# EasyEDA Pro project deskpet.eprj

# Schematic Schematic1
Board Name: control board; Create Date: 2025-11-04; Page Name: P1; Project Name: deskpet; Schematic Name: Schematic1; Update Date: 2025-11-22; Company: EasyEDA.com; Page Size: A4; Version: V1.0
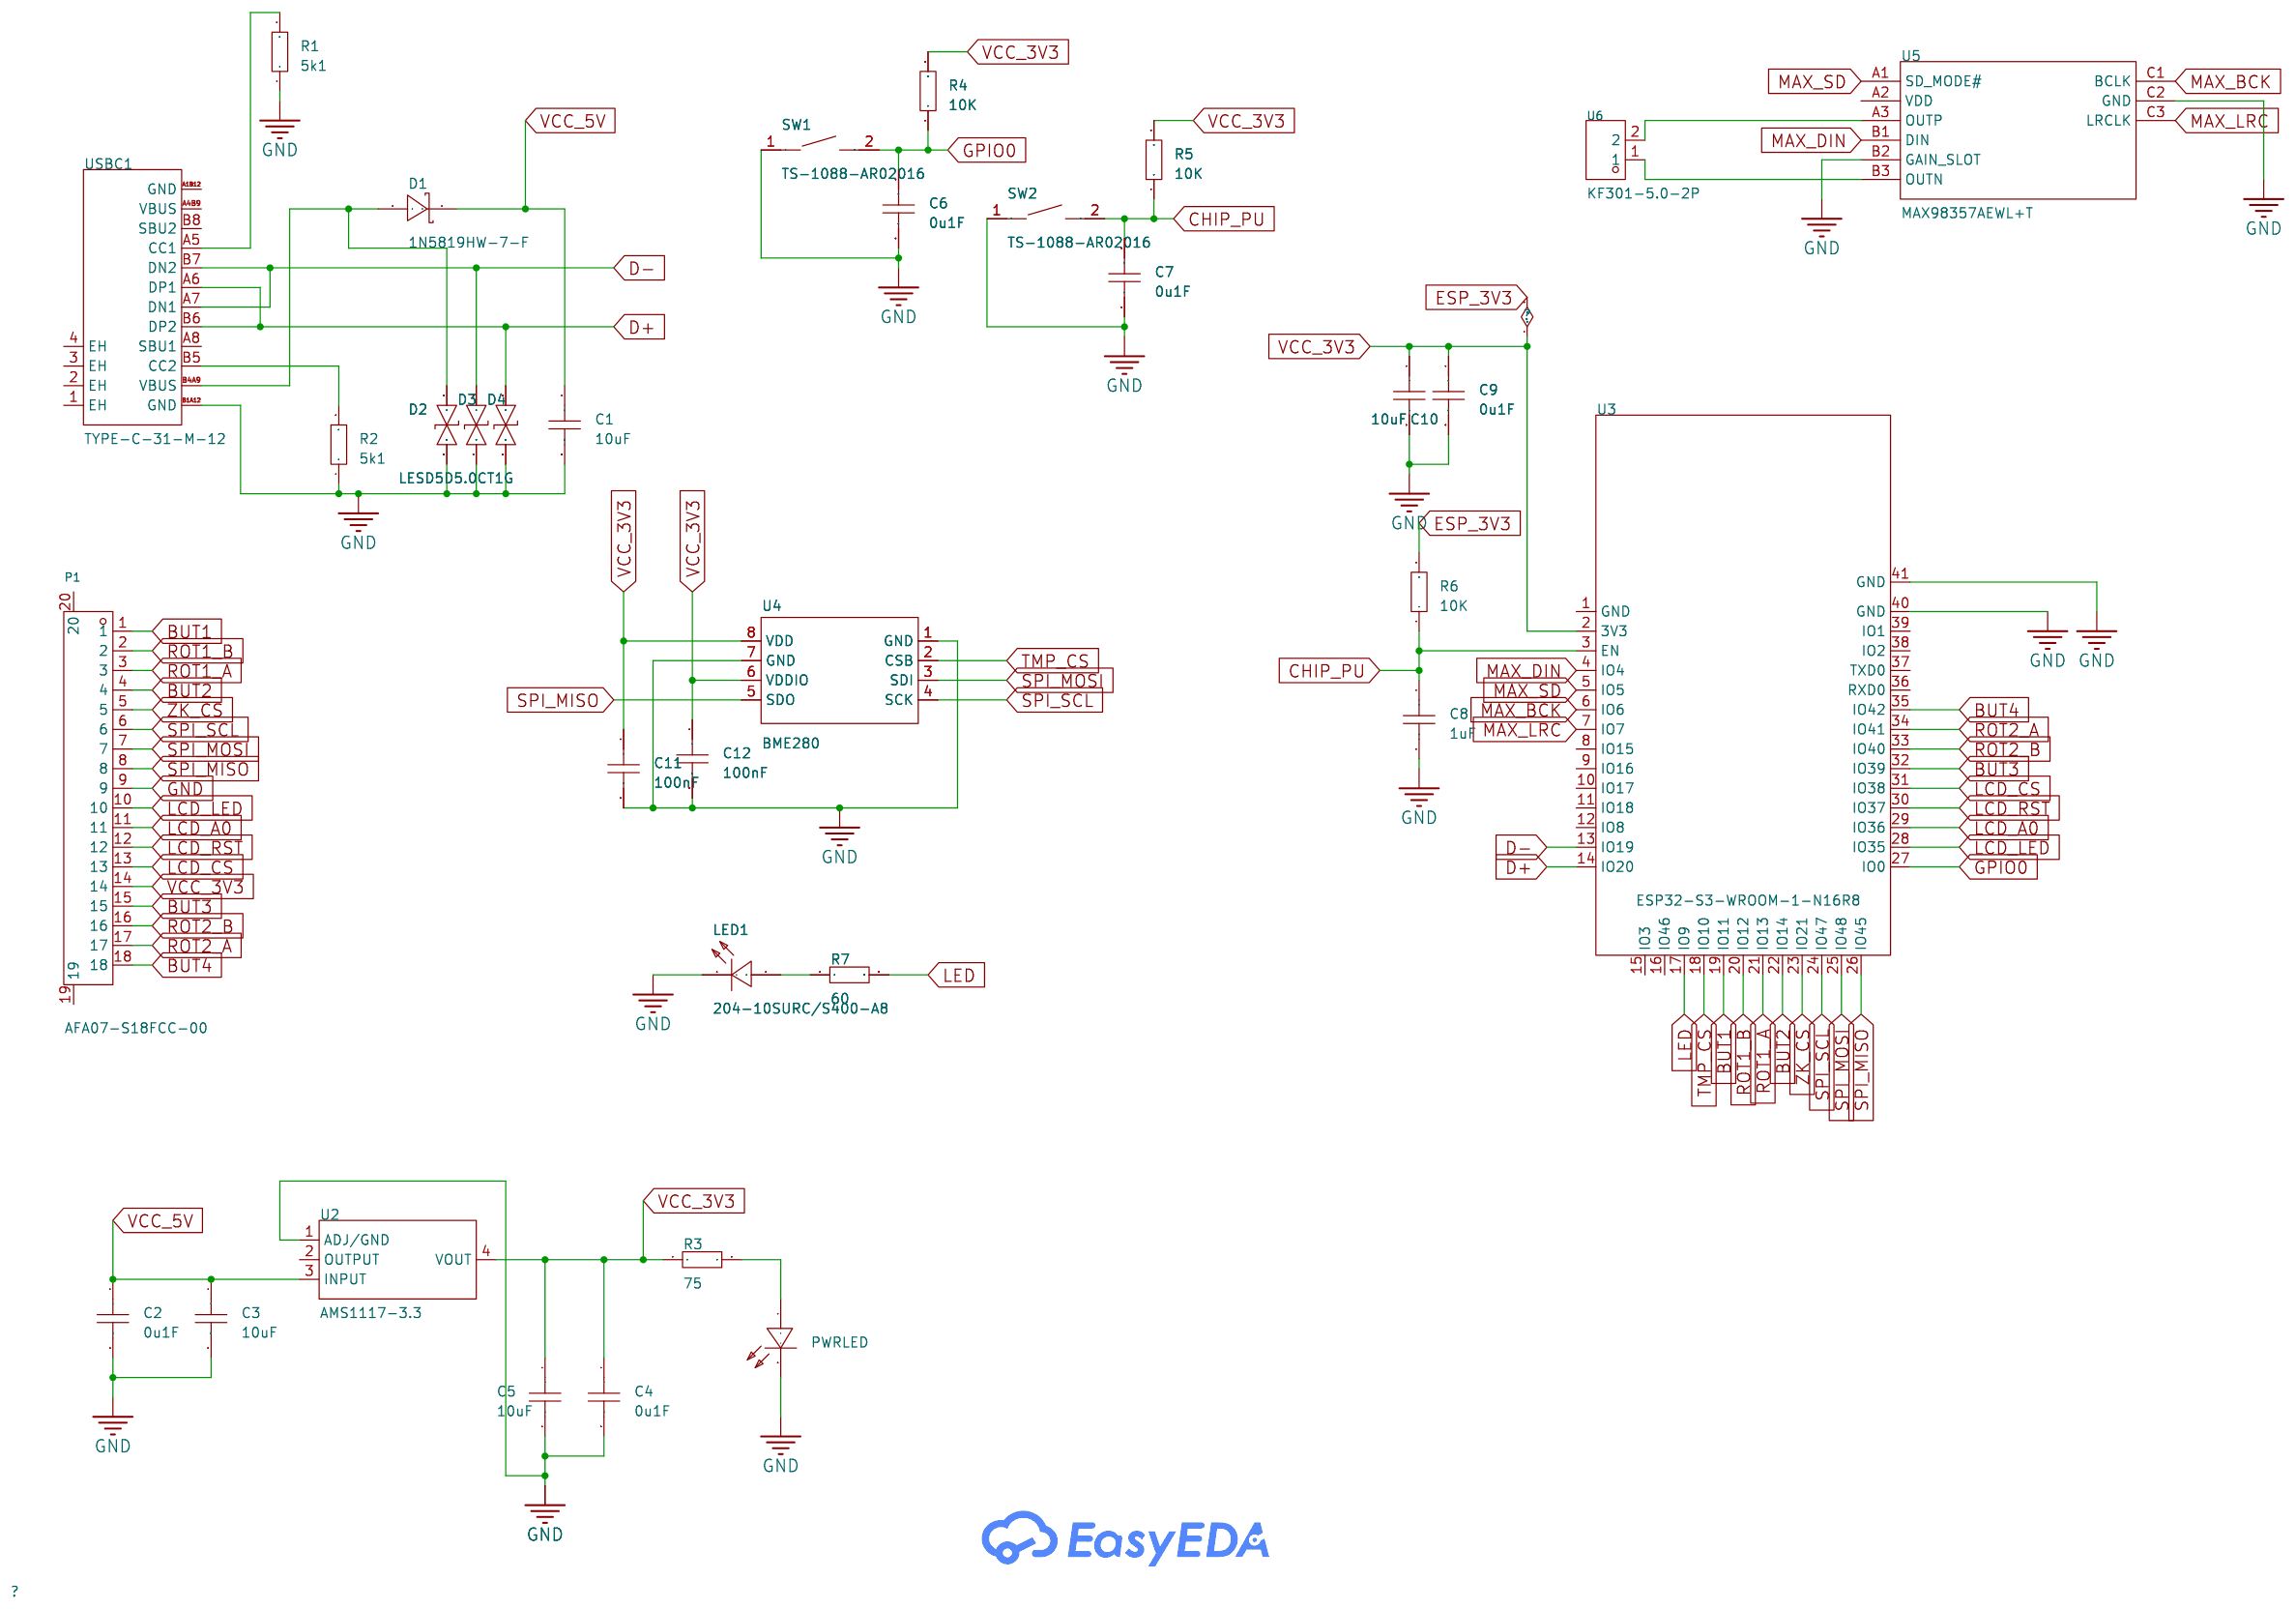
[diagram p0: schematic sheet]

## Parts
C1  10uF  [C0603]
C2  0u1F  [C0603]
C3  10uF  [C0603]
C4  0u1F  [C0603]
C5  10uF  [C0603]
C6  0u1F  [C0603]
C7  0u1F  [C0603]
C8  1uF  [C0603]
C9  0u1F  [C0603]
C10  10uF  [C0603]
C11  100nF  [C0603]
C12  100nF  [C0603]
D1  1N5819HW-7-F  [SOD-123_L2.7-W1.6-LS3.7-RD]
D2  LESD5D5.0CT1G  [SOD-523_L1.2-W0.8-LS1.6-BI]
D3  LESD5D5.0CT1G  [SOD-523_L1.2-W0.8-LS1.6-BI]
D4  LESD5D5.0CT1G  [SOD-523_L1.2-W0.8-LS1.6-BI]
LED1  204-10SURC/S400-A8  [LED-TH_BD3.0-P2.54-RD-WHITE]
P1  AFA07-S18FCC-00  [FPC-SMD_18P-P1.00_AFA07-S18FCC-00]
PWRLED  NCD0805R1  [LED0805-R-RD]
R1  5k1  [R0603]
R2  5k1  [R0603]
R3  75  [R0603]
R4  10K  [R0603]
R5  10K  [R0603]
R6  10K  [R0603]
R7  60  [R0603]
SW1  TS-1088-AR02016  [SW-SMD_L3.9-W3.0-P4.45]
SW2  TS-1088-AR02016  [SW-SMD_L3.9-W3.0-P4.45]
U2  AMS1117-3.3  [SOT-223-3_L6.5-W3.4-P2.30-LS7.0-BR]
U3  ESP32-S3-WROOM-1-N16R8  [WIRELM-SMD_ESP32-S3-WROOM-1]
U4  BME280  [LGA-8_BME280_BL]
U5  MAX98357AEWL+T  [WLP-9_L1.4-W1.3-P0.40-R3-C3-BR]
U6  KF301-5.0-2P  [CONN-TH_P5.00_KF301-5.0-2P]
USBC1  TYPE-C-31-M-12  [USB-C_SMD-TYPE-C-31-M-12_1]

## Library data of the parts
C1-C12 = CAP_0603: Supplier Footprint: 0603
D1 = 1N5819HW-7-F: LCSC Part Name: 电压:40V 电流:1A; Supplier Part: C82544; Manufacturer: DIODES(美台); Supplier Footprint: SOD-123; JLCPCB Part Class: Extended Part; Datasheet: https://item.szlcsc.com/datasheet/1N5819HW-7-F/83701.html; Supplier: LCSC; Diode Configuration: 1 Independent; Voltage - Forward(Vf@If): 450mV@1A; Voltage - DC Reverse(Vr): 40V; Current - Rectified: 1A; Reverse Leakage Current (Ir): 1mA@40V; Operating Junction Temperature Range: -65℃~+150℃; Non-Repetitive Peak Forward Surge Current: 25A
D2-D4 = LESD5D5.0CT1G_C41399463: LCSC Part Name: 双向ESD 5V截止 峰值脉冲电流：7A; Supplier Part: C41399463; Manufacturer: GOODWORK(固得沃克); Supplier Footprint: SOD-523; JLCPCB Part Class: Extended Part; Datasheet: https://item.szlcsc.com/datasheet/LESD5D5.0CT1G/43196790.html; Supplier: LCSC; Polarity: Bidirectional; Reverse Stand-Off Voltage (Vrwm): 5V; Clamping Voltage: 16V; Peak Pulse Current (Ipp): 7A; Peak Pulse Power Dissipation (Ppp): 100W; Voltage - Breakdown: 7V; Reverse Leakage Current (Ir): 1uA; Operating Temperature: -55℃~+150℃@(Tj); level of protection: IEC 61000-4-2; Type: ESD; Junction Capacitance: 12pF
LED1 = 204-10SURC/S400-A8: LCSC Part Name: 红灯; Supplier Part: C471418; Manufacturer: EVERLIGHT(亿光); Supplier Footprint: 插件,D=3mm; JLCPCB Part Class: Extended Part; Datasheet: https://atta.szlcsc.com/upload/public/pdf/source/20191231/C471418_B2E5B14029423C5111631A9992549771.pdf; Supplier: LCSC; Lamp Holder Type: 3mm圆形灯头; Emitted Color: Red; Forward Voltage (VF): 2V; Power Dissipation: 120mW; Forward Current: 20mA; Dominant Wavelength: 624nm; Peak Wavelength: 632nm; Lens Color: 无色透明透镜; Luminous Intensity: 2000mcd; Viewing Angle: 20°; Operating Temperature: -40℃~+85℃
P1 = AFA07-S18FCC-00: LCSC Part Name: 间距:1mm P数:18P 抽屉式 下接; Supplier Part: C23826; Manufacturer: JS(钜硕电子); Supplier Footprint: SMD,P=1mm,卧贴; JLCPCB Part Class: Extended Part; Datasheet: https://item.szlcsc.com/datasheet/AFA07-S18FCC-00/24565.html; Supplier: LCSC; Locking Feature: Slide Lock; Contact Type: Bottom Contact; Number of Contacts: 18P; Pitch: 1mm; Mounting Type: Surface Mount, Right Angle; FFC, FCB Thickness: 0.3mm; Height Above Board: 2.5mm
PWRLED = NCD0805R1_C84256: Supplier Part: C84256; Manufacturer: 国星光电; Supplier Footprint: 0805; JLCPCB Part Class: Basic Part; Datasheet: https://atta.szlcsc.com/upload/public/pdf/source/20200820/C84256_F0A75A43B3EAD75808600A0514C76B99.pdf; Supplier: LCSC; Emitted Color: Red; Forward Voltage (VF): 1.6V~2.6V; Power Dissipation: 65mW; Forward Current: 20mA; Dominant Wavelength: 615nm~630nm; Diode Configuration: 独立二极管; Lens Color: 无色透明透镜; Luminous Intensity: 67mcd~195mcd; Viewing Angle: 130°; Operating Temperature: -30℃~+85℃
R1-R7 = Res_0603: Supplier Footprint: 0603
SW1 SW2 = TS-1088-AR02016: LCSC Part Name: 4*3*2mm 立贴 轻触开关; Supplier Part: C720477; Manufacturer: XUNPU(讯普); Supplier Footprint: SMD,4x3mm; JLCPCB Part Class: Basic Part; Datasheet: https://item.szlcsc.com/datasheet/TS-1088-AR02016/763484.html; Supplier: LCSC; Circuit: SPST; Actuator Style: Round Button; Operating Force: 1.6N; Mounting Type: Surface Mount,Vertical; Length: 4mm; Width: 3mm; Switch Height: 2mm; with Bracket: Without Bracket; Contact Current: 50mA; Voltage Rating: 12V; Actuator/Cap Color: Black; Termination Style: SMD(SMT) Tab; Life: 100,000 Cycles; Operating Temperature: -30℃~+80℃
U2 = AMS1117-3.3_C18212698: Supplier Part: C18212698; Manufacturer: TECH PUBLIC(台舟); Supplier Footprint: SOT-223; JLCPCB Part Class: Extended Part; Datasheet: https://item.szlcsc.com/datasheet/AMS1117-3.3/19384486.html; Supplier: LCSC; Output Type: Fixed; Voltage - Supply: 12V; Output Voltage: 3.3V; Output Current: 1A; Voltage Dropout: 1.3V@(1A); standby current: 4mA; Output Configuration: Positive; Number of Outputs: 1
U3 = ESP32-S3-WROOM-1-N16R8: LCSC Part Name: 通用型Wi-Fi+低功耗蓝牙MCU模组; Supplier Part: C2913202; Manufacturer: ESPRESSIF(乐鑫); Supplier Footprint: SMD,25.5x18mm; JLCPCB Part Class: Extended Part; Datasheet: https://item.szlcsc.com/datasheet/ESP32-S3-WROOM-1-N16R8/3198300.html; Supplier: LCSC
U4 = BME280: LCSC Part Name: 湿度：0%RH~100%RH; Supplier Part: C92489; Manufacturer: Bosch(博世); Supplier Footprint: LGA-8(2.5x2.5); JLCPCB Part Class: Extended Part; Datasheet: https://item.szlcsc.com/datasheet/BME280/93682.html; Supplier: LCSC; Temperature Range: -40℃~+85℃; Humidity: 0%RH~100%RH; Interface: I2C；SPI; Voltage - Supply: 1.71V~3.6V; Current - Supply: 1.8uA; Humidity Tolerance: ±3%RH; Temperature Tolerance: ±0.5℃; Resolution: 16bit
U5 = MAX98357AEWL+T: LCSC Part Name: 微型、低成本、PCM 类 D 级放大器具有 AB 级性能; Supplier Part: C2682619; Manufacturer: ADI(亚德诺)/MAXIM(美信); Supplier Footprint: BGA-9(1.3x1.3); JLCPCB Part Class: Extended Part; Datasheet: https://atta.szlcsc.com/upload/public/pdf/source/20210106/C2682619_15CCD654F2C559A2FC5FDCA8EA0D4E6D.pdf; Supplier: LCSC; Speaker Channels: Monaural；Dual Channel; Voltage - Supply: 2.5V~5.5V; Operating Temperature: -40℃~+85℃
U6 = KF301-5.0-2P: LCSC Part Name: 5mm 1x2P 排数:1 每排P数:2 直插; Supplier Part: C474881; Manufacturer: KEFA(科发); Supplier Footprint: 插件,P=5mm; JLCPCB Part Class: Extended Part; Datasheet: https://atta.szlcsc.com/upload/public/pdf/source/20230317/03A5B5FC229D6F9225E8F51DA1A4E80A.pdf; Supplier: LCSC; Structure: 1x2P; Pitch: 5mm; Color: Blue; Mounting Style: Straight; Current Rating (Max): 17A; Voltage Rating (Max): 250V; Number of Pins: 2P; Number of Rows: 1; Wire Gauge - AWG: 14~22; Wire Gauge - mm2: 1.5; Number of PINs Per Row: 2; Operating Temperature Range: -30℃~+120℃
USBC1 = TYPE-C-31-M-12: LCSC Part Name: Type-C 母; Supplier Part: C165948; Manufacturer: 韩国韩荣; Supplier Footprint: SMD; JLCPCB Part Class: Extended Part; Datasheet: https://item.szlcsc.com/datasheet/TYPE-C-31-M-12/177331.html; Supplier: LCSC; Connector Type: Type-C; Gender: Female; Number of Contacts: 16P; Number of Ports: 1; Current Rating-Power: 5A

## Nets
GND: C1.2 C2.2 C3.2 C4.2 C5.2 C6.2 C7.2 C8.2 C9.2 C10.2 C11.2 C12.2 D2.2 D3.2 D4.2 LED1.1(-) P1.9 PWRLED.2(-) R1.1 R2.1 SW1.1 SW2.1 U2.1(ADJ/GND) U3.40(GND) U3.41(GND) U4.1(GND) U4.7(GND) U5.B2(GAIN_SLOT) U5.C2(GND) USBC1.B1A12(GND)
VCC_5V: C1.1 C2.1 C3.1 D1.1(K) U2.3(INPUT)
BUT1: P1.1 U3.19(IO11)
BUT2: P1.4 U3.22(IO14)
BUT3: P1.15 U3.32(IO39)
BUT4: P1.18 U3.35(IO42)
CHIP_PU: C7.1 C8.1 R5.1 R6.1 SW2.2 U3.3(EN)
D+: D4.1 U3.14(IO20) USBC1.A6(DP1) USBC1.B6(DP2)
D-: D3.1 U3.13(IO19) USBC1.A7(DN1) USBC1.B7(DN2)
ESP_3V3: C4.1 C5.1 C9.1 C10.1 C11.1 C12.1 P1.14 R3.1 R4.2 R5.2 R6.2 U2.4(VOUT) U3.2(3V3) U4.6(VDDIO) U4.8(VDD)
GPIO0: C6.1 R4.1 SW1.2 U3.27(IO0)
LCD_A0: P1.11 U3.29(IO36)
LCD_CS: P1.13 U3.31(IO38)
LCD_LED: P1.10 U3.28(IO35)
LCD_RST: P1.12 U3.30(IO37)
LED: R7.2 U3.17(IO9)
MAX_BCK: U3.6(IO6) U5.C1(BCLK)
MAX_DIN: U3.4(IO4) U5.B1(DIN)
MAX_LRC: U3.7(IO7) U5.C3(LRCLK)
MAX_SD: U3.5(IO5) U5.A1(SD_MODE#)
ROT1_A: P1.3 U3.21(IO13)
ROT1_B: P1.2 U3.20(IO12)
ROT2_A: P1.17 U3.34(IO41)
ROT2_B: P1.16 U3.33(IO40)
SPI_MISO: P1.8 U3.26(IO45) U4.5(SDO)
SPI_MOSI: P1.7 U3.25(IO48) U4.3(SDI)
SPI_SCL: P1.6 U3.24(IO47) U4.4(SCK)
TMP_CS: U3.18(IO10) U4.2(CSB)
ZK_CS: P1.5 U3.23(IO21)
$1N817: R1.2 USBC1.A5(CC1)
$1N957: R2.2 USBC1.B5(CC2)
$1N1070: D1.2(A) D2.1 USBC1.B4A9(VBUS)
$1N1958: PWRLED.1(+) R3.2
$1N13454: U5.A3(OUTP) U6.2
$1N13459: U5.B3(OUTN) U6.1
$1N13765: LED1.2(+) R7.1

Not connected (* = marked no-connect by the designer): P1 19 20; U2 2(OUTPUT); U3 1(GND) 8(IO15) 9(IO16) 10(IO17) 11(IO18) 12(IO8) 15(IO3) 16(IO46) 36(RXD0) 37(TXD0) 38(IO2) 39(IO1); U5 A2(VDD); USBC1 1(EH) 2(EH) 3(EH) 4(EH) A1B12(GND) A4B9(VBUS) A8(SBU1) B8(SBU2)

# Schematic Schematic3
Board Name: io board; Create Date: 2025-11-06; Page Name: P1; Project Name: deskpet; Schematic Name: Schematic3; Update Date: 2025-11-11; Company: EasyEDA.com; Page Size: A4; Version: V1.0
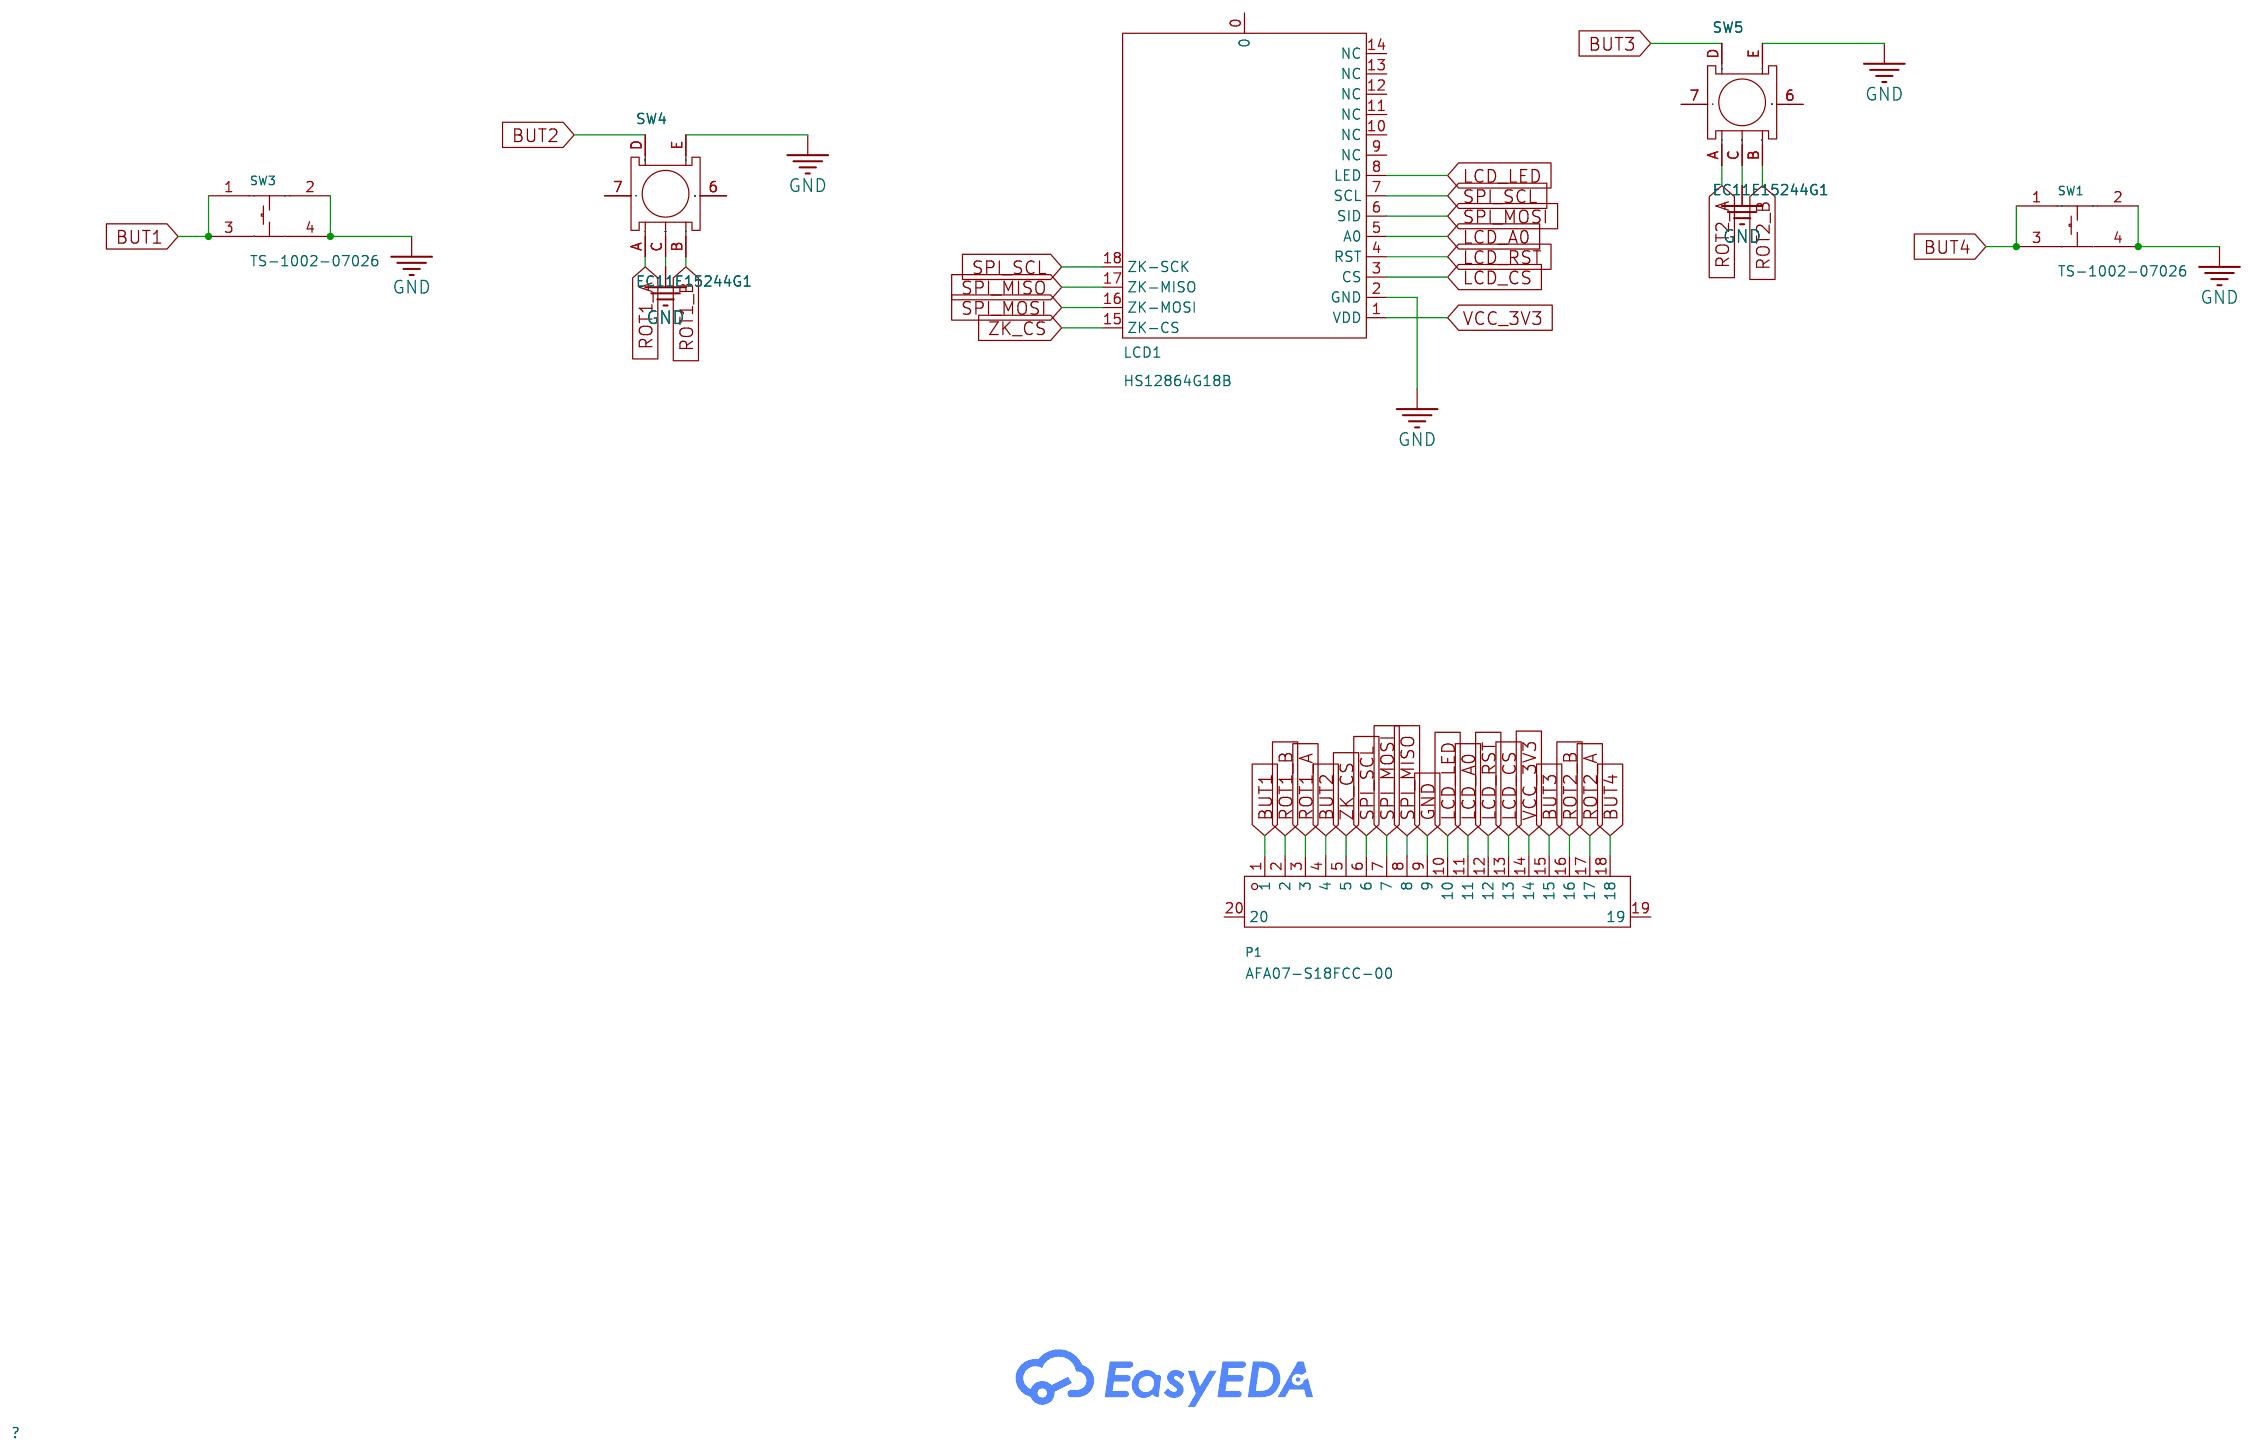
[diagram p1: schematic sheet]

## Parts
LCD1  HS12864G18B  [COMM-TH_HS12864G18B]
P1  AFA07-S18FCC-00  [FPC-SMD_18P-P1.00_AFA07-S18FCC-00]
SW1  TS-1002-07026  [SW-TH_4P-L6.0-W6.0-P4.50-LS6.5]
SW3  TS-1002-07026  [SW-TH_4P-L6.0-W6.0-P4.50-LS6.5]
SW4  EC11E15244G1  [SW-TH_EC11E15244G1]
SW5  EC11E15244G1  [SW-TH_EC11E15244G1]

## Library data of the parts
LCD1 = HS12864G18B: LCSC Part Name: 3寸 图形点阵LCD液晶屏LCM显示屏; Supplier Part: C2939940; Manufacturer: HS(汉昇); JLCPCB Part Class: Extended Part; Datasheet: https://atta.szlcsc.com/upload/public/pdf/source/20220121/6EC60B578A9E55E72FCDEAFC91BB0B90.pdf; Supplier: LCSC; Main Control Chip: ST7567; Size: 3
P1 = AFA07-S18FCC-00: LCSC Part Name: 间距:1mm P数:18P 抽屉式 下接; Supplier Part: C23826; Manufacturer: JS(钜硕电子); Supplier Footprint: SMD,P=1mm,卧贴; JLCPCB Part Class: Extended Part; Datasheet: https://item.szlcsc.com/datasheet/AFA07-S18FCC-00/24565.html; Supplier: LCSC; Locking Feature: Slide Lock; Contact Type: Bottom Contact; Number of Contacts: 18P; Pitch: 1mm; Mounting Type: Surface Mount, Right Angle; FFC, FCB Thickness: 0.3mm; Height Above Board: 2.5mm
SW1 SW3 = TS-1002-07026: LCSC Part Name: 6*6*7mm 直插 轻触开关; Supplier Part: C455095; Manufacturer: XUNPU(讯普); Supplier Footprint: 插件,6x6mm; JLCPCB Part Class: Extended Part; Datasheet: https://item.szlcsc.com/datasheet/TS-1002-07026/457500.html; Supplier: LCSC; Circuit: SPST; Actuator Style: Round Button; Mounting Type: Through Hole; Length: 6mm; Width: 6mm; Switch Height: 7mm; Contact Current: 50mA; Voltage Rating: 12V
SW4 SW5 = EC11E15244G1: LCSC Part Name: 编码器; Supplier Part: C370970; Manufacturer: ALPSALPINE(阿尔卑斯阿尔派); Supplier Footprint: 插件; JLCPCB Part Class: Extended Part; Datasheet: https://item.szlcsc.com/datasheet/EC11E15244G1/344654.html; Supplier: LCSC

## Nets
GND: LCD1.2(GND) P1.9 SW1.2 SW1.4 SW3.2 SW3.4 SW4.C SW4.E SW5.C SW5.E
VCC_3V3: LCD1.1(VDD) P1.14
BUT1: P1.1 SW3.1 SW3.3
BUT2: P1.4 SW4.D
BUT3: P1.15 SW5.D
BUT4: P1.18 SW1.1 SW1.3
LCD_A0: LCD1.5(A0) P1.11
LCD_CS: LCD1.3(CS) P1.13
LCD_LED: LCD1.8(LED) P1.10
LCD_RST: LCD1.4(RST) P1.12
ROT1_A: P1.3 SW4.A
ROT1_B: P1.2 SW4.B
ROT2_A: P1.17 SW5.A
ROT2_B: P1.16 SW5.B
SPI_MISO: LCD1.17(ZK-MISO) P1.8
SPI_MOSI: LCD1.6(SID) LCD1.16(ZK-MOSI) P1.7
SPI_SCL: LCD1.7(SCL) LCD1.18(ZK-SCK) P1.6
ZK_CS: LCD1.15(ZK-CS) P1.5

Not connected (* = marked no-connect by the designer): LCD1 0 9(NC) 10(NC) 11(NC) 12(NC) 13(NC) 14(NC); P1 19 20; SW4 6 7; SW5 6 7

# Board PCB5
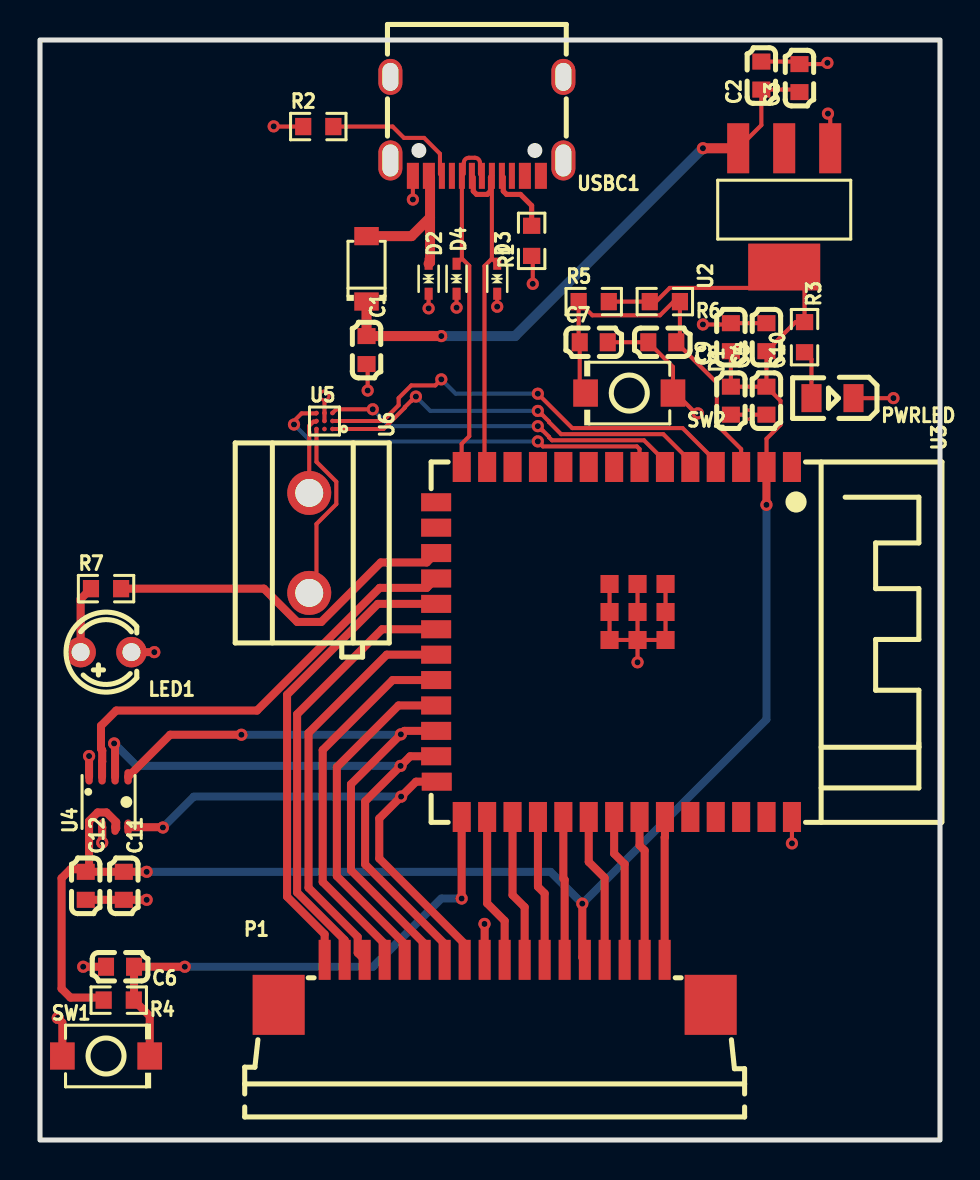
[diagram p2: board, top side]
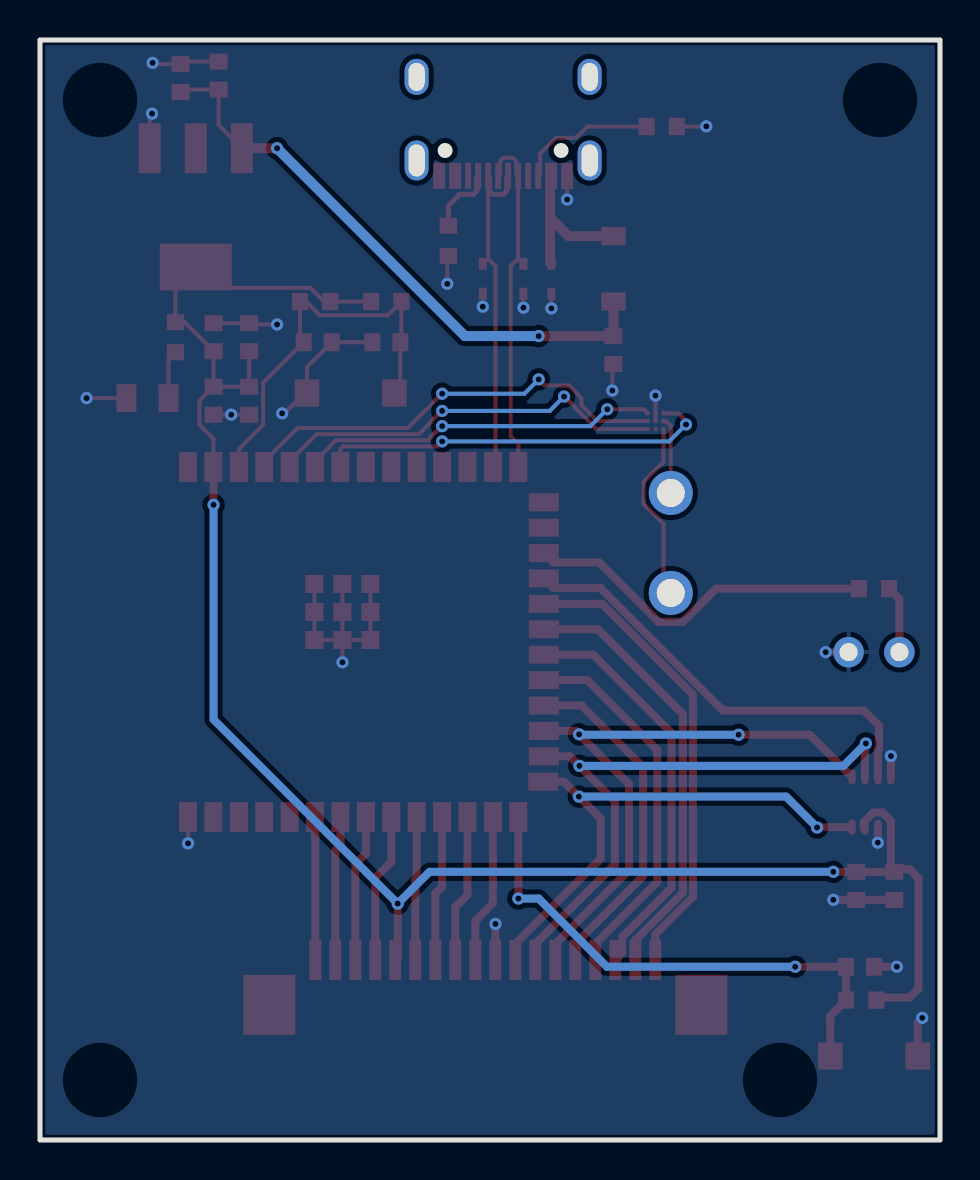
[diagram p3: board, bottom side, seen from below]

Outline 45 x 55 mm; copper layers: Top Layer, Bottom Layer. Coordinates in mm from the lower left corner of the outline.
Outline path: rectangle 0,55 45,0
Stack: Top Layer 0.035mm / Dielectric1 1.51mm FR4 er 4.5 / Bottom Layer 0.035mm

## Design rules (mm)
net D-: DP1
net D+: DP1
template: Custom Config
spacing copperThickness1oz (default): track to track 0.102, other pairs 0.152 to 0.3
spacing copperThickness2oz: track to track 0.203, other pairs 0.152 to 0.3
track width copperThickness1oz (default): min 0.1, default 0.5, max 2.54
track width copperThickness2oz: min 0.203, default 0.254, max 2.54
differential pair differentialPair (default): width min 0.127, default 0.254, max 2.54; gap min 0.152, default 0.152
via viaSize (default): diameter min 0.5, default 0.61, max 10; hole min 0.3, default 0.305, max 6.3

## Placement (name value [footprint] x y rotation side)
C1  10uF  [C0603]  16.33 39.5 270 top
C2  0u1F  [C0603]  36.07 53.22 90 top
C3  10uF  [C0603]  37.97 53.09 90 top
C4  0u1F  [C0603]  36.32 40.14 90 top
C5  10uF  [C0603]  34.54 36.97 270 top
C6  0u1F  [C0603]  4 8.66 180 top
C7  0u1F  [C0603]  27.69 39.89 0 top
C8  1uF  [C0603]  31.12 39.89 180 top
C9  0u1F  [C0603]  34.54 40.14 90 top
C10  10uF  [C0603]  36.32 36.97 270 top
C11  100nF  [C0603]  4.19 12.71 270 top
C12  100nF  [C0603]  2.29 12.71 270 top
D1  1N5819HW-7-F  [SOD-123_L2.7-W1.6-LS3.7-RD]  16.33 43.56 90 top
D2  LESD5D5.0CT1G  [SOD-523_L1.2-W0.8-LS1.6-BI]  19.43 43.06 270 top
D3  LESD5D5.0CT1G  [SOD-523_L1.2-W0.8-LS1.6-BI]  22.86 43.06 270 top
D4  LESD5D5.0CT1G  [SOD-523_L1.2-W0.8-LS1.6-BI]  20.83 43.06 270 top
LED1  204-10SURC/S400-A8  [LED-TH_BD3.0-P2.54-RD-WHITE]  3.3 24.39 180 top
P1  AFA07-S18FCC-00  [FPC-SMD_18P-P1.00_AFA07-S18FCC-00]  22.73 7.88 0 top
PWRLED  NCD0805R1  [LED0805-R-RD]  39.62 37.09 180 top
R1  5k1  [R0603]  24.58 44.96 90 top
R2  5k1  [R0603]  13.91 50.67 0 top
R3  75  [R0603]  38.23 40.14 270 top
R4  10K  [R0603]  3.94 6.99 180 top
R5  10K  [R0603]  27.69 41.92 0 top
R6  10K  [R0603]  31.24 41.92 180 top
R7  60  [R0603]  3.3 27.57 0 top
SW1  TS-1088-AR02016  [SW-SMD_L3.9-W3.0-P4.45]  3.3 4.2 0 top
SW2  TS-1088-AR02016  [SW-SMD_L3.9-W3.0-P4.45]  29.46 37.35 180 top
U2  AMS1117-3.3  [SOT-223-3_L6.5-W3.4-P2.30-LS7.0-BR]  37.21 46.62 90 top
U3  ESP32-S3-WROOM-1-N16R8  [WIRELM-SMD_ESP32-S3-WROOM-1]  28.7 24.9 270 top
U4  BME280  [LGA-8_BME280_BL]  3.43 16.9 90 top
U5  MAX98357AEWL+T  [WLP-9_L1.4-W1.3-P0.40-R3-C3-BR]  14.22 35.95 0 top
U6  KF301-5.0-2P  [CONN-TH_P5.00_KF301-5.0-2P]  13.46 29.85 270 top
USBC1  TYPE-C-31-M-12  [USB-C_SMD-TYPE-C-31-M-12_1]  21.84 50.68 180 top

## Footprints (pads in the part's own frame, mm; a bottom-side part is the same pattern mirrored in y, then rotated)
C0603
  rect 0.8x0.9 smd: 1(-0.7,0) 2(0.7,0)
CONN-TH_P5.00_KF301-5.0-2P
  round 2.2 hole 1.4: 1(-2.5,0) 2(2.5,0)
FPC-SMD_18P-P1.00_AFA07-S18FCC-00
  rect 0.6x2 smd: 1(-8.5,1.125) 2(-7.5,1.125) 3(-6.5,1.125) 4(-5.5,1.125) 5(-4.5,1.125) 6(-3.5,1.125) 7(-2.5,1.125) 8(-1.5,1.125) 9(-0.5,1.125) 10(0.5,1.125) 11(1.5,1.125) 12(2.5,1.125) 13(3.499,1.125) 14(4.509,1.125) 15(5.5,1.125) 16(6.5,1.125) 17(7.5,1.125) 18(8.5,1.125)
  rect 2.6x3 smd: 19(-10.8,-1.125) 20(10.8,-1.125)
LED0805-R-RD
  rect 1x1.399 smd: 1(1.05,0) 2(-1.05,0)
LED-TH_BD3.0-P2.54-RD-WHITE
  round 1.524 hole 0.9: 1(-1.27,0) 2(1.27,0)
LGA-8_BME280_BL
  oval 0.767x0.364 smd: 1(1.258,0.975) 2(1.258,0.325) 3(1.258,-0.325) 4(1.258,-0.975) 5(-1.258,-0.975) 6(-1.258,-0.325) 7(-1.258,0.325) 8(-1.258,0.975)
R0603
  rect 0.806x0.864 smd: 1(-0.753,0) 2(0.753,0)
SOD-123_L2.7-W1.6-LS3.7-RD
  rect 0.91x1.22 smd: 1(-1.635,0) 2(1.635,0)
SOD-523_L1.2-W0.8-LS1.6-BI
  rect 0.6x0.4 smd: 1(-0.75,0) 2(0.75,0)
SOT-223-3_L6.5-W3.4-P2.30-LS7.0-BR
  rect 2.5x1.1 smd: 1(2.97,-2.3) 2(2.97,0) 3(2.97,2.3)
  rect 2.34x3.6 smd: 4(-2.97,0)
SW-SMD_L3.9-W3.0-P4.45
  rect 1.23x1.36 smd: 1(-2.185,0) 2(2.185,0)
USB-C_SMD-TYPE-C-31-M-12_1
  oval 1.2x2 hole 0.8x1.6: 1(4.325,1.706) 4(-4.325,1.706)
  oval 1.2x1.8 hole 0.8x1.4: 2(4.325,-2.474) 3(-4.325,-2.474)
  custom 0.6x1.3 smd: A1B12(-3.2,2.474) A4B9(-2.4,2.474) B1A12(3.2,2.474) B4A9(2.401,2.474)
  rect 0.3x1.3 smd: A5(-1.25,2.474) A6(-0.25,2.474) A7(0.25,2.474) A8(1.25,2.474) B5(1.75,2.474) B6(0.75,2.474) B7(-0.75,2.474) B8(-1.75,2.474)
WIRELM-SMD_ESP32-S3-WROOM-1
  rect 1.5x0.9 smd: 1(-8.75,8.895) 2(-8.75,7.625) 3(-8.75,6.355) 4(-8.75,5.085) 5(-8.75,3.815) 6(-8.75,2.545) 7(-8.75,1.275) 8(-8.75,0.005) 9(-8.75,-1.265) 10(-8.75,-2.535) 11(-8.75,-3.805) 12(-8.75,-5.075) 13(-8.75,-6.345) 14(-8.75,-7.615) 27(8.75,-7.615) 28(8.75,-6.345) 29(8.75,-5.075) 30(8.75,-3.805) 31(8.75,-2.535) 32(8.75,-1.265) 33(8.75,0.005) 34(8.75,1.275) 35(8.75,2.545) 36(8.75,3.815) 37(8.75,5.085) 38(8.75,6.355) 39(8.75,7.625) 40(8.75,8.895)
  rect 0.9x1.5 smd: 15(-6.985,-8.895) 16(-5.715,-8.895) 17(-4.445,-8.895) 18(-3.175,-8.895) 19(-1.905,-8.895) 20(-0.635,-8.895) 21(0.635,-8.895) 22(1.905,-8.895) 23(3.175,-8.895) 24(4.445,-8.895) 25(5.715,-8.895) 26(6.985,-8.865)
  rect 0.9x0.9 smd: 41(-2.9,2.575) 41(-2.9,1.175) 41(-2.9,-0.225) 41(-1.5,2.575) 41(-1.5,1.175) 41(-1.5,-0.225) 41(-0.1,2.575) 41(-0.1,1.175) 41(-0.1,-0.225)
WLP-9_L1.4-W1.3-P0.40-R3-C3-BR
  round 0.23 smd: A1(0.4,-0.4) A2(0,-0.4) A3(-0.4,-0.4) B1(0.4,0) B2(0,0) B3(-0.4,0) C1(0.4,0.4) C2(0,0.4) C3(-0.4,0.4)

## Nets
As in the schematic.

Pads without a net: P1 19 20; U2 2; U3 1 8 9 10 11 12 15 16 36 37 38 39; U5 A2; USBC1 1 2 3 4 A1B12 A4B9 A8 B8

## Via types
v1: diameter 0.61, hole 0.305, Top Layer to Bottom Layer, 44 vias

## Routing (per net, layer and track width the routed paths; a pad name or vN(x,y) marks a point on that pad's centre or on a via; arc(x,y) is an arc through that point)
GND: length 52.2
  Top Layer w0.203: U3.41 v1(29.88,23.89) ; U3.41 U3.41 U3.41 U3.41 ; U3.41 U3.41 U3.41 U3.41 ; U3.41 U3.41 U3.41 ; C5.2 v1(35.44,36.27) C10.2 ; USBC1.B1A12 v1(18.64,47.02) ; D4.2 v1(20.83,41.62) ; v1(39.37,53.86) 39.31,53.8 C3.2 37.85,53.92 C2.2 ; R1.1 24.64,44.15 v1(24.64,42.81) ; R2.1 11.69,50.67 v1(11.68,50.68) ; v1(16.38,37.47) 16.38,38.74 C1.2 ; v1(14.22,37.22) U5.C2 U5.B2 ; U2.1 39.51,51.21 v1(39.4,51.32) ; C7.2 C8.2 31.65,38.65 31.65,37.47 32.79,36.33 v1(32.89,36.33) ; D2.2 v1(19.43,41.58) ; v1(33.15,40.78) 34.48,40.78 34.54,40.84 36.32,40.84 ; PWRLED.2 v1(42.67,37.09) ; D3.2 v1(22.86,41.67) ; U3.40 v1(37.6,14.83)
  Top Layer w0.4: v1(5.33,12.01) C11.2 C12.2 ; C6.2 v1(2.16,8.66) ; LED1.1 v1(5.72,24.39) ; v1(22.22,10.8) 22.23,10.8 P1.9 ; v1(0.89,6.1) 1.12,5.88 SW1.1 ; U4.7 3.11,15.63 v1(3.11,14.87) ; U4.1 v1(2.45,19.2)
VCC_5V: length 29.6
  Top Layer w0.203: C3.1 37.85,52.52 C2.1 36.07,50.75 U2.3
  Top Layer w0.5: D1.1 C1.1 v1(20.07,40.2) ; U2.3 v1(33.15,49.59)
  Bottom Layer w0.5: v1(20.07,40.2) 23.75,40.2 v1(33.15,49.59)
BUT1: length 23.4
  Top Layer w0.4: U3.19 16.89,26.81 12.35,22.27 12.35,12.17 14.23,10.29 P1.1
BUT2: length 18.9
  Top Layer w0.4: U3.22 17.63,23 14.13,19.5 14.13,12.9 17.23,9.81 P1.4
BUT3: length 7.5
  Top Layer w0.4: P1.15 28.23,13.11 27.44,13.9 U3.32
BUT4: length 7.1
  Top Layer w0.4: U3.35 31.25,15.15 31.23,15.13 P1.18
CHIP_PU: length 19.9
  Top Layer w0.203: 27.28,37.47 26.99,37.77 C7.1 26.93,39.94 R5.1 27.62,41.23 31,41.23 31.68,41.92 R6.1 32,40.07 C8.1 33.84,37.86 33.84,35.76 35.06,34.54 U3.3
D+: length 17.6
  Top Layer w0.203: 21.19,48.3 21.19,48.86 arc(21.26,49.04) 21.44,49.11 21.74,49.11 arc(21.92,49.04) 22,48.86 22,48.32 arc(22.01,48.3) 22.02,48.29 USBC1.A6 ; 21.09,44.08 D4.1 ; 21.09,44.08 21.46,43.71 21.46,35.19 21.08,34.81 21.08,33.66 U3.14 ; 21.09,44.08 USBC1.B6
D-: length 17.7
  Top Layer w0.203: USBC1.B7 22.59,44.08 ; 22.59,44.08 D3.1 ; 22.59,44.08 22.59,44.07 22.22,43.7 22.22,33.78 U3.13 ; USBC1.A7 21.59,48.17
  Top Layer w0.254: 21.66,48.14 21.66,47.44 21.83,47.28 22.36,47.28 22.52,47.44 22.52,48.14 USBC1.B7
ESP_3V3: length 91
  Top Layer w0.203: C10.1 C4.1 37.78,40.89 R3.1 38.23,42.63 U2.4 ; C10.1 37.03,36.96 37.03,35.76 36.33,35.06 U3.2 ; C10.1 C5.1 C9.1 ; R5.2 R6.2 30.8,41.92 31.49,42.6 35.53,42.6
  Top Layer w0.4: v1(27.12,11.82) 27.12,9.14 P1.14 ; U4.6 3.81,15.59 3.81,15.89 3.32,16.38 2.88,16.38 2.45,15.95 U4.8 2.45,13.58 C12.1 ; v1(5.33,13.41) C11.1 C12.1 ; C12.1 2.16,13.54 1.52,13.54 1.08,13.09 1.08,7.57 1.52,7.12 3.06,7.12 R4.2 ; v1(36.32,31.76) 36.32,33.65 U3.2
  Bottom Layer w0.4: v1(5.33,13.41) 25.53,13.41 v1(27.12,11.82) 36.32,21.03 v1(36.32,31.76)
GPIO0: length 26.7
  Top Layer w0.4: v1(7.24,8.66) C6.1 4.7,7.01 R4.1 5.49,6.2 SW1.2 ; v1(21.08,12.07) 21.08,16.15 U3.27
  Bottom Layer w0.4: v1(7.24,8.66) 16.66,8.66 20.07,12.07 v1(21.08,12.07)
LCD_A0: length 7.4
  Top Layer w0.4: P1.11 24.23,11.64 23.63,12.25 U3.29
LCD_CS: length 7.2
  Top Layer w0.4: P1.13 26.23,13.01 26.17,13.08 U3.31
LCD_LED: length 7.5
  Top Layer w0.4: U3.28 22.36,11.83 23.23,10.96 P1.10
LCD_RST: length 7.3
  Top Layer w0.4: U3.30 24.9,12.66 25.23,12.33 P1.12
LED: length 17.9
  Top Layer w0.4: U3.17 19.34,28.88 17.04,28.88 14.06,25.9 12.86,25.9 11.19,27.57 R7.2
MAX_BCK: length 18.1
  Top Layer w0.203: v1(24.89,35.69) 25.1,35.49 25.12,35.49 25.45,35.16 25.45,35.13 25.6,34.98 30.2,34.98 31.25,33.94 U3.6 ; v1(16.64,36.54) 14.81,36.54 U5.C1
  Bottom Layer w0.203: v1(24.89,35.69) 17.48,35.69 v1(16.64,36.54)
MAX_DIN: length 22.2
  Top Layer w0.203: U3.4 33.79,33.94 32.13,35.6 26.61,35.6 v1(24.89,37.31) ; U5.B1 17.14,35.95 17.93,36.74 17.93,37.1 18.56,37.73 19.76,37.73 v1(20.07,38.03)
  Bottom Layer w0.203: v1(20.07,38.03) 20.78,37.31 v1(24.89,37.31)
MAX_LRC: length 20.1
  Top Layer w0.203: v1(24.89,34.93) 25.14,34.68 29.84,34.68 29.98,34.55 U3.7 ; U5.C3 13.81,36.33 13.08,36.33 12.7,35.95 v1(12.7,35.77)
  Bottom Layer w0.203: v1(24.89,34.93) 13.54,34.93 v1(12.7,35.77)
MAX_SD: length 20.2
  Top Layer w0.203: U3.5 32.52,33.94 31.17,35.29 26.06,35.29 25.45,35.9 25.45,35.92 25.12,36.25 25.1,36.25 v1(24.89,36.45) ; v1(18.8,37.17) 18.59,36.97 18.56,36.97 18.24,36.64 18.24,36.61 17.18,35.55 U5.A1
  Bottom Layer w0.203: v1(18.8,37.17) 19.51,36.45 v1(24.89,36.45)
ROT1_A: length 20.5
  Top Layer w0.4: P1.3 15.88,9.36 15.88,10.15 13.43,12.61 13.43,20.35 17.34,24.27 U3.21
ROT1_B: length 22
  Top Layer w0.4: U3.20 17.1,25.54 12.86,21.29 12.86,12.37 15.23,10 P1.2
ROT2_A: length 7.2
  Top Layer w0.4: P1.17 30.23,14.48 29.98,14.73 U3.34
ROT2_B: length 7.4
  Top Layer w0.4: U3.33 28.71,14.32 29.23,13.79 P1.16
SPI_MISO: length 26.8
  Top Layer w0.4: P1.8 21.23,9.81 16.96,14.08 16.96,16.08 v1(18.06,17.17) 18.8,17.92 U3.26 ; U4.5 6.13,15.64 v1(6.15,15.62)
  Bottom Layer w0.4: v1(6.15,15.62) 7.69,17.17 v1(18.06,17.17)
SPI_MOSI: length 30.5
  Top Layer w0.4: v1(3.71,19.83) 3.75,19.78 U4.3 ; U3.25 18.51,19.19 v1(18.03,18.71) 16.26,16.93 16.26,13.78 20.23,9.81 P1.7
  Bottom Layer w0.4: v1(3.71,19.83) 4.83,18.71 v1(18.03,18.71)
SPI_SCL: length 30.2
  Top Layer w0.4: U3.24 18.22,20.46 15.55,17.79 15.55,13.49 19.23,9.81 P1.6 ; U4.4 6.51,20.26 v1(10.07,20.26)
  Bottom Layer w0.4: v1(18.04,20.28) 18.02,20.26 v1(10.07,20.26)
TMP_CS: length 22.4
  Top Layer w0.4: U4.2 3.1,18.92 3.11,18.93 3.11,19.47 3.1,19.48 3.1,19.5 3.05,19.56 3.05,20.71 3.81,21.47 10.85,21.47 16.99,27.61 19.34,27.61 U3.18
ZK_CS: length 17.3
  Top Layer w0.4: P1.5 18.23,9.81 14.84,13.2 14.84,18.64 17.92,21.73 U3.23
$1N817: length 3.5
  Top Layer w0.254: R1.2 24.58,46.72 24.02,47.28 23.33,47.28 23.16,47.44 23.16,48.14 USBC1.A5
$1N957: length 7
  Top Layer w0.203: R2.2 17.63,50.67 18.2,50.11 19.2,50.11 20,49.31 20,48.3 USBC1.B5
$1N1070: length 8
  Top Layer w0.5: 19.5,46.12 19.5,48.15 USBC1.B4A9 ; 19.5,46.12 18.58,45.19 D1.2 ; 19.5,46.12 19.5,43.88 D2.1
$1N1958: length 2.4
  Top Layer w0.203: PWRLED.1 38.57,39.04 R3.2
$1N13454: length 9.2
  Top Layer w0.203: U5.A3 13.82,33.91 14.82,32.91 14.82,31.79 13.82,30.8 13.82,27.72 U6.2
$1N13459: length 3.8
  Top Layer w0.203: U5.B3 13.79,35.92 13.67,35.92 13.46,35.7 13.46,35.4 13.46,35.39 U6.1
$1N13765: length 3.4
  Top Layer w0.4: LED1.2 2.03,27.05 R7.1

## Copper pours and planes (outline as drawn; the poured copper is in the pictures)
GND on Bottom Layer: 0,55 45,55 45,0 0,0

# Board PCB8
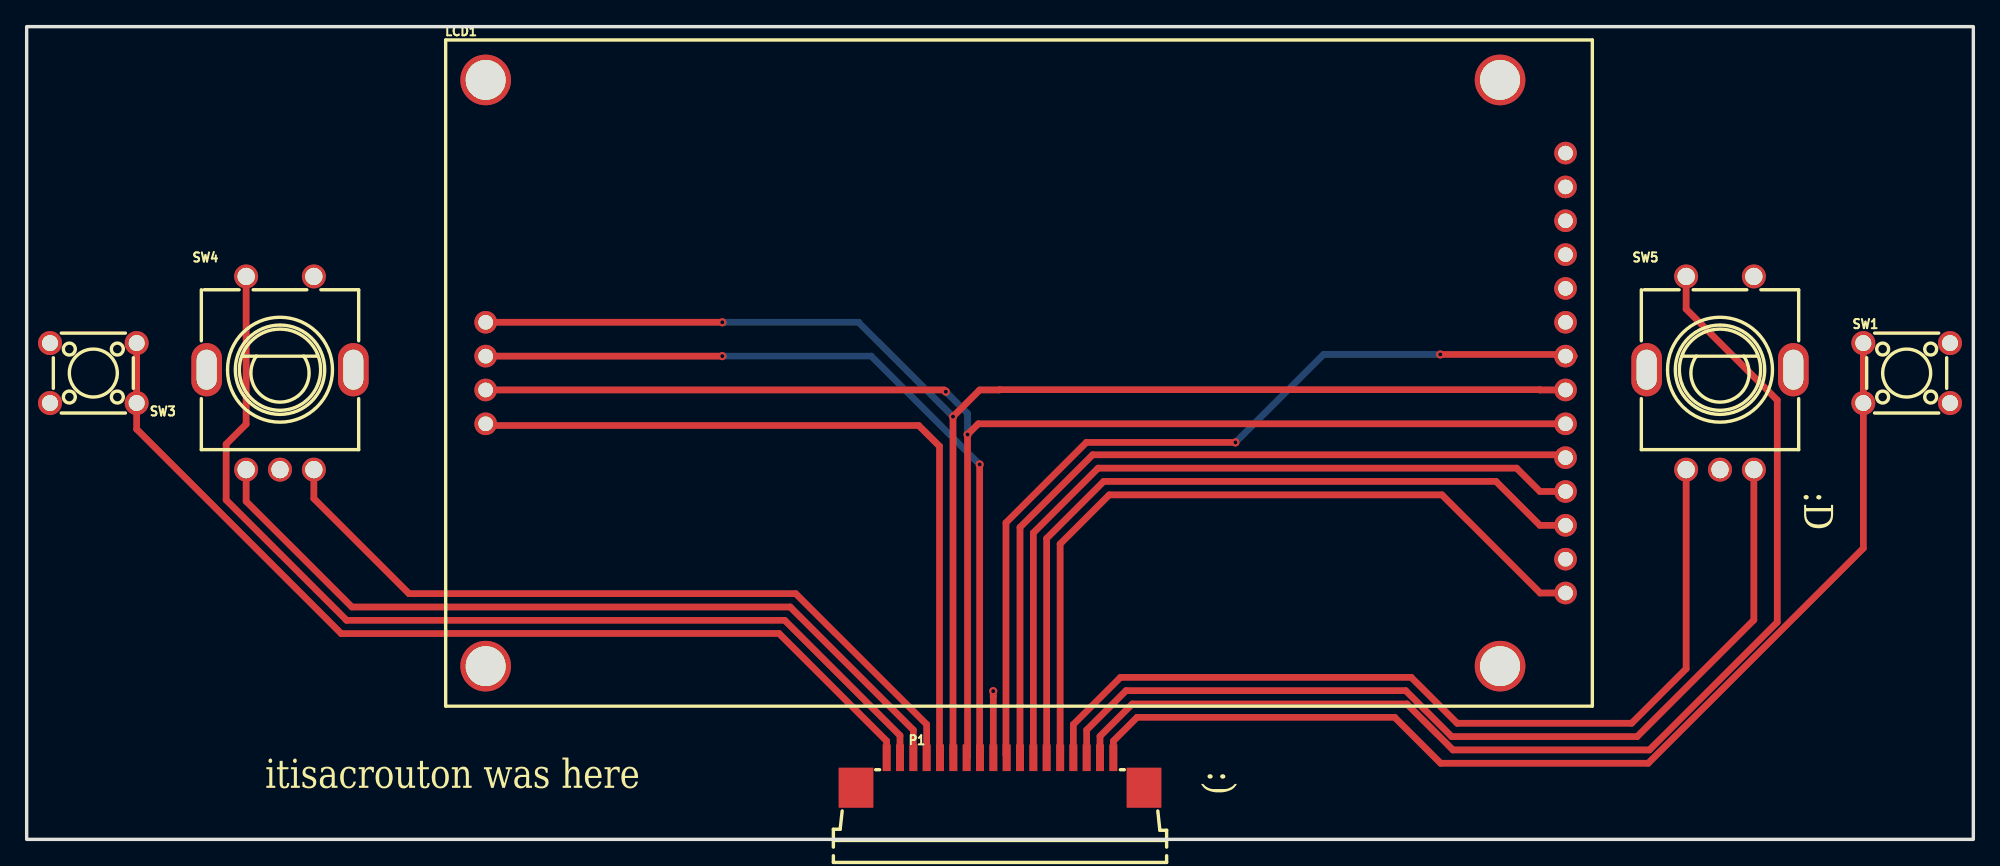
[diagram p4: board, top side]
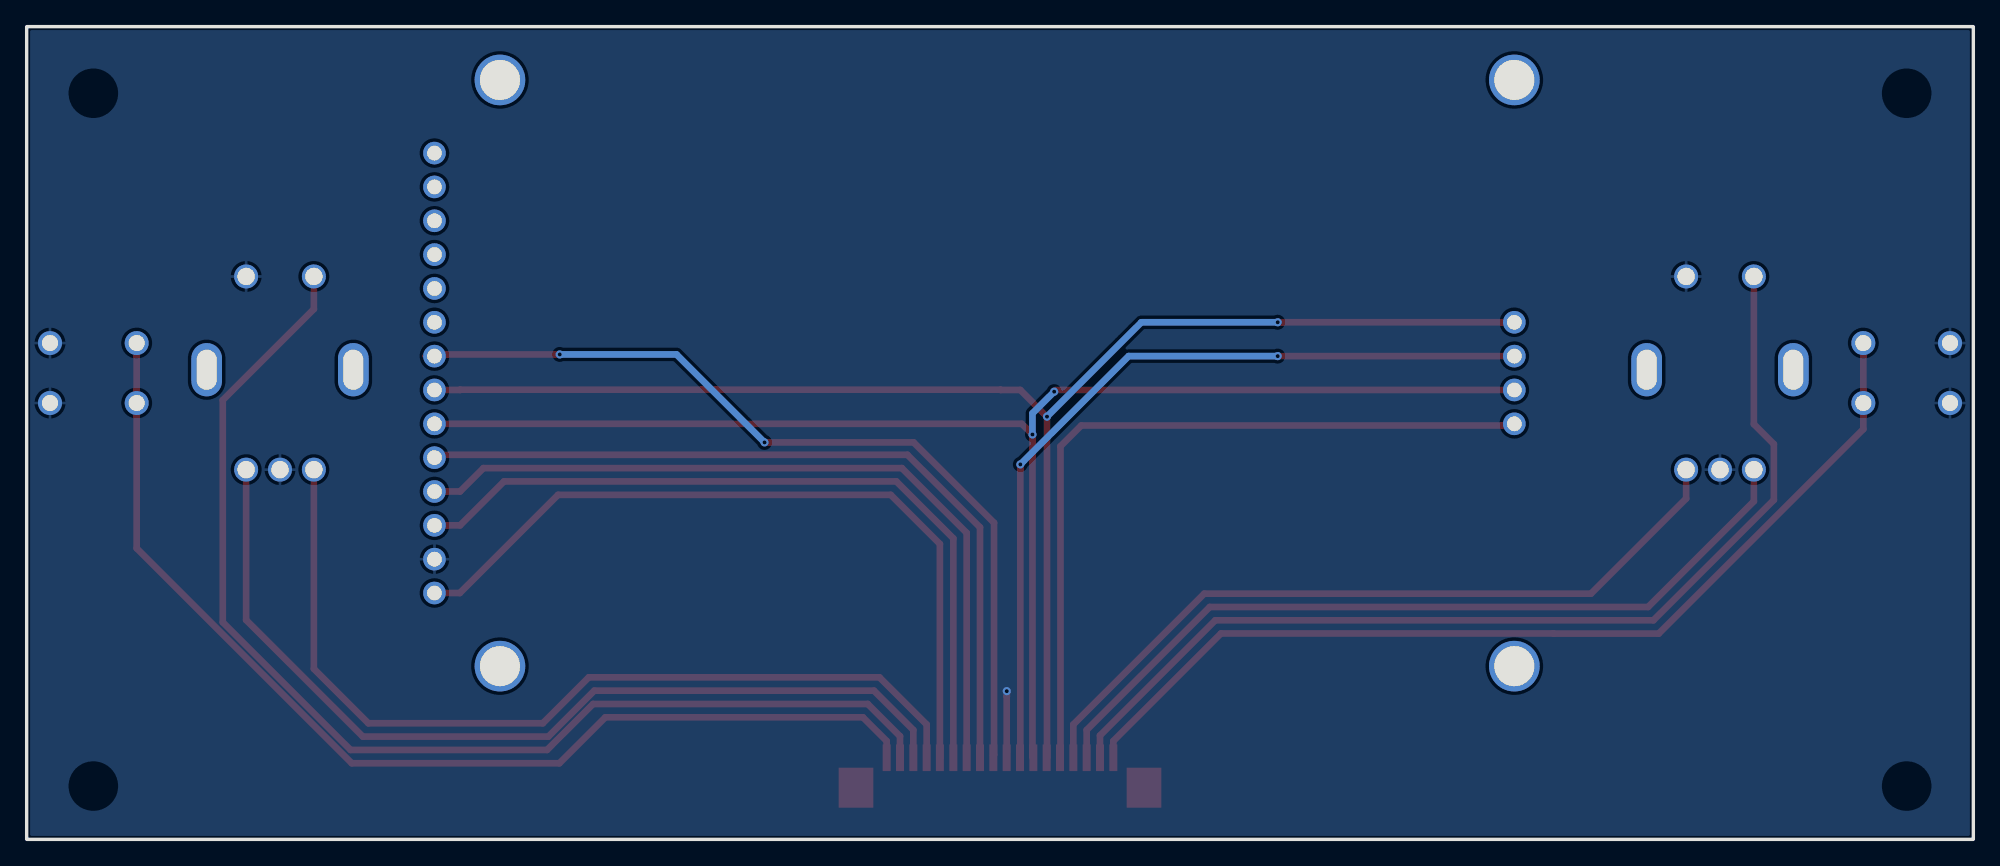
[diagram p5: board, bottom side, seen from below]

Outline 146 x 61 mm; copper layers: Top Layer, Bottom Layer. Coordinates in mm from the lower left corner of the outline.
Outline path: rectangle 0,61 146,0
Stack: Top Layer 0.035mm / Dielectric1 1.51mm FR4 er 4.5 / Bottom Layer 0.035mm

## Design rules (mm)
template: Custom Config
spacing copperThickness1oz (default): track to track 0.102, other pairs 0.152 to 0.3
spacing copperThickness2oz: track to track 0.203, other pairs 0.152 to 0.3
track width copperThickness1oz (default): min 0.127, default 0.8, max 2.54
track width copperThickness2oz: min 0.203, default 0.254, max 2.54
differential pair differentialPair (default): width min 0.127, default 0.254, max 2.54; gap min 0.152, default 0.152
via viaSize (default): diameter min 0.5, default 0.61, max 10; hole min 0.3, default 0.305, max 6.3

## Placement (name value [footprint] x y rotation side)
LCD1  HS12864G18B  [COMM-TH_HS12864G18B]  74.92 35 0 top
P1  AFA07-S18FCC-00  [FPC-SMD_18P-P1.00_AFA07-S18FCC-00]  73 5 0 top
SW1  TS-1002-07026  [SW-TH_4P-L6.0-W6.0-P4.50-LS6.5]  141 35 0 top
SW3  TS-1002-07026  [SW-TH_4P-L6.0-W6.0-P4.50-LS6.5]  5 35 180 top
SW4  EC11E15244G1  [SW-TH_EC11E15244G1]  19 35 0 top
SW5  EC11E15244G1  [SW-TH_EC11E15244G1]  127 35 0 top

## Footprints (pads in the part's own frame, mm; a bottom-side part is the same pattern mirrored in y, then rotated)
COMM-TH_HS12864G18B
  round 3.8 hole 3: 0(-40.495,22) 0(-40.495,-22) 0(35.585,22) 0(35.585,-22)
  round 1.7 hole 1.1: 1(40.495,-16.51) 2(40.495,-13.97) 3(40.495,-11.43) 4(40.495,-8.89) 5(40.495,-6.35) 6(40.495,-3.81) 7(40.495,-1.27) 8(40.495,1.27) 9(40.495,3.81) 10(40.495,6.35) 11(40.495,8.89) 12(40.495,11.43) 13(40.495,13.97) 14(40.495,16.51) 15(-40.495,-3.81) 16(-40.495,-1.27) 17(-40.495,1.27) 18(-40.495,3.81)
FPC-SMD_18P-P1.00_AFA07-S18FCC-00
  rect 0.6x2 smd: 1(-8.5,1.125) 2(-7.5,1.125) 3(-6.5,1.125) 4(-5.5,1.125) 5(-4.5,1.125) 6(-3.5,1.125) 7(-2.5,1.125) 8(-1.5,1.125) 9(-0.5,1.125) 10(0.5,1.125) 11(1.5,1.125) 12(2.5,1.125) 13(3.499,1.125) 14(4.509,1.125) 15(5.5,1.125) 16(6.5,1.125) 17(7.5,1.125) 18(8.5,1.125)
  rect 2.6x3 smd: 19(-10.8,-1.125) 20(10.8,-1.125)
SW-TH_4P-L6.0-W6.0-P4.50-LS6.5
  round 1.8 hole 1.2: 1(-3.25,2.25) 2(3.25,2.25) 3(-3.25,-2.25) 4(3.25,-2.25)
SW-TH_EC11E15244G1
  oval 2.3x4 hole 1.5x3: 6(5.5,0.25) 7(-5.5,0.25)
  round 1.8 hole 1.3: A(-2.54,-7.25) B(2.54,-7.25) C(0,-7.25) D(-2.54,7.25) E(2.54,7.25)

## Nets
GND: LCD1.2 P1.9 SW1.2 SW1.4 SW3.2 SW3.4 SW4.C SW4.E SW5.C SW5.E
VCC_3V3: LCD1.1 P1.14
BUT1: P1.1 SW3.1 SW3.3
BUT2: P1.2 SW4.D
BUT3: P1.17 SW5.D
BUT4: P1.18 SW1.1 SW1.3
LCD_A0: LCD1.5 P1.11
LCD_CS: LCD1.3 P1.13
LCD_LED: LCD1.8 P1.10
LCD_RST: LCD1.4 P1.12
ROT1_A: P1.3 SW4.A
ROT1_B: P1.4 SW4.B
ROT2_A: P1.15 SW5.A
ROT2_B: P1.16 SW5.B
SPI_MISO: LCD1.17 P1.8
SPI_MOSI: LCD1.6 LCD1.16 P1.7
SPI_SCL: LCD1.7 LCD1.18 P1.6
ZK_CS: LCD1.15 P1.5

Pads without a net: LCD1 0 9 10 11 12 13 14; P1 19 20; SW4 6 7; SW5 6 7

## Via types
v1: diameter 0.61, hole 0.305, Top Layer to Bottom Layer, 9 vias

## Routing (per net, layer and track width the routed paths; a pad name or vN(x,y) marks a point on that pad's centre or on a via; arc(x,y) is an arc through that point)
GND: length 4.6
  Top Layer w0.5: 72.5,6.54 72.5,10.74 72.49,10.74 v1(72.49,11.12)
VCC_3V3: length 58.5
  Top Layer w0.5: P1.14 77.51,22.17 81.19,25.86 106.15,25.86 113.51,18.49 LCD1.1
BUT1: length 73.7
  Top Layer w0.5: SW3.3 SW3.1 8.25,30.79 23.6,15.44 31.48,15.44 31.49,15.45 56.43,15.45 64.5,7.38 P1.1
BUT2: length 76.9
  Top Layer w0.5: SW4.D 16.46,31.17 14.96,29.67 14.96,25.47 23.99,16.44 56.85,16.44 65.5,7.79 P1.2
BUT3: length 87.6
  Top Layer w0.5: SW5.D 124.46,39.8 131.29,32.97 131.29,16.3 121.71,6.71 106.97,6.71 103.52,10.16 82.92,10.16 80.5,7.74 P1.17
BUT4: length 81.8
  Top Layer w0.5: P1.18 81.5,7.38 83.28,9.16 102.6,9.16 106.05,5.71 121.61,5.71 137.75,21.85 SW1.3 SW1.1
LCD_A0: length 60.6
  Top Layer w0.5: LCD1.5 115.2,28.86 79.95,28.86 74.5,23.42 P1.11
LCD_CS: length 58.5
  Top Layer w0.5: P1.13 76.5,22.59 80.77,26.87 110.2,26.87 113.5,23.57 LCD1.3
LCD_LED: length 66.1
  Top Layer w0.5: v1(106.02,36.4) 115.94,36.4 116.06,36.27 LCD1.8 ; 73.5,6.29 73.45,6.34 73.45,23.76 79.48,29.79 v1(90.66,29.79)
  Bottom Layer w0.5: v1(106.02,36.4) 97.26,36.4 v1(90.66,29.79)
LCD_RST: length 59.5
  Top Layer w0.5: LCD1.4 113.5,26.11 111.74,27.86 80.36,27.86 75.5,23 P1.12
ROT1_A: length 61.6
  Top Layer w0.5: SW4.A 16.46,25.37 24.39,17.44 57.27,17.44 66.5,8.21 P1.3
ROT1_B: length 57.7
  Top Layer w0.5: P1.4 67.5,8.62 57.68,18.44 28.68,18.44 21.54,25.58 SW4.B
ROT2_A: length 68
  Top Layer w0.5: P1.15 78.5,8.62 82.04,12.16 103.84,12.16 107.29,8.71 120.37,8.71 124.46,12.8 SW5.A
ROT2_B: length 69.7
  Top Layer w0.5: P1.16 79.5,8.21 82.45,11.16 103.43,11.16 106.88,7.71 120.78,7.71 129.54,16.47 SW5.B
SPI_MISO: length 61.8
  Top Layer w0.5: 71.48,6.73 v1(71.48,28.14) ; v1(52.17,36.27) LCD1.17
  Bottom Layer w0.5: v1(52.17,36.27) 63.35,36.27 v1(71.48,28.14)
SPI_MOSI: length 107.9
  Top Layer w0.5: v1(68.94,33.6) 68.81,33.73 LCD1.16 ; P1.7 70.57,6.19 v1(70.57,30.39) 71.37,31.19 LCD1.6
  Bottom Layer w0.5: v1(68.94,33.6) 70.57,31.97 v1(70.57,30.39)
SPI_SCL: length 110.4
  Top Layer w0.5: LCD1.7 113.5,33.73 113.47,33.75 72.97,33.75 72.95,33.73 71.48,33.73 v1(69.48,31.73) 69.48,6.15 P1.6 ; v1(52.17,38.81) LCD1.18
  Bottom Layer w0.5: v1(69.48,31.73) 62.4,38.81 v1(52.17,38.81)
ZK_CS: length 58
  Top Layer w0.5: LCD1.15 34.55,31.06 66.9,31.06 68.46,29.5 68.46,6.29

## Copper pours and planes (outline as drawn; the poured copper is in the pictures)
GND on Bottom Layer: 0,61 146,61 146,0 0,0

## Text on the board
Top Silkscreen Layer: itisacrouton was here | :) | :D

# Board newiopcb
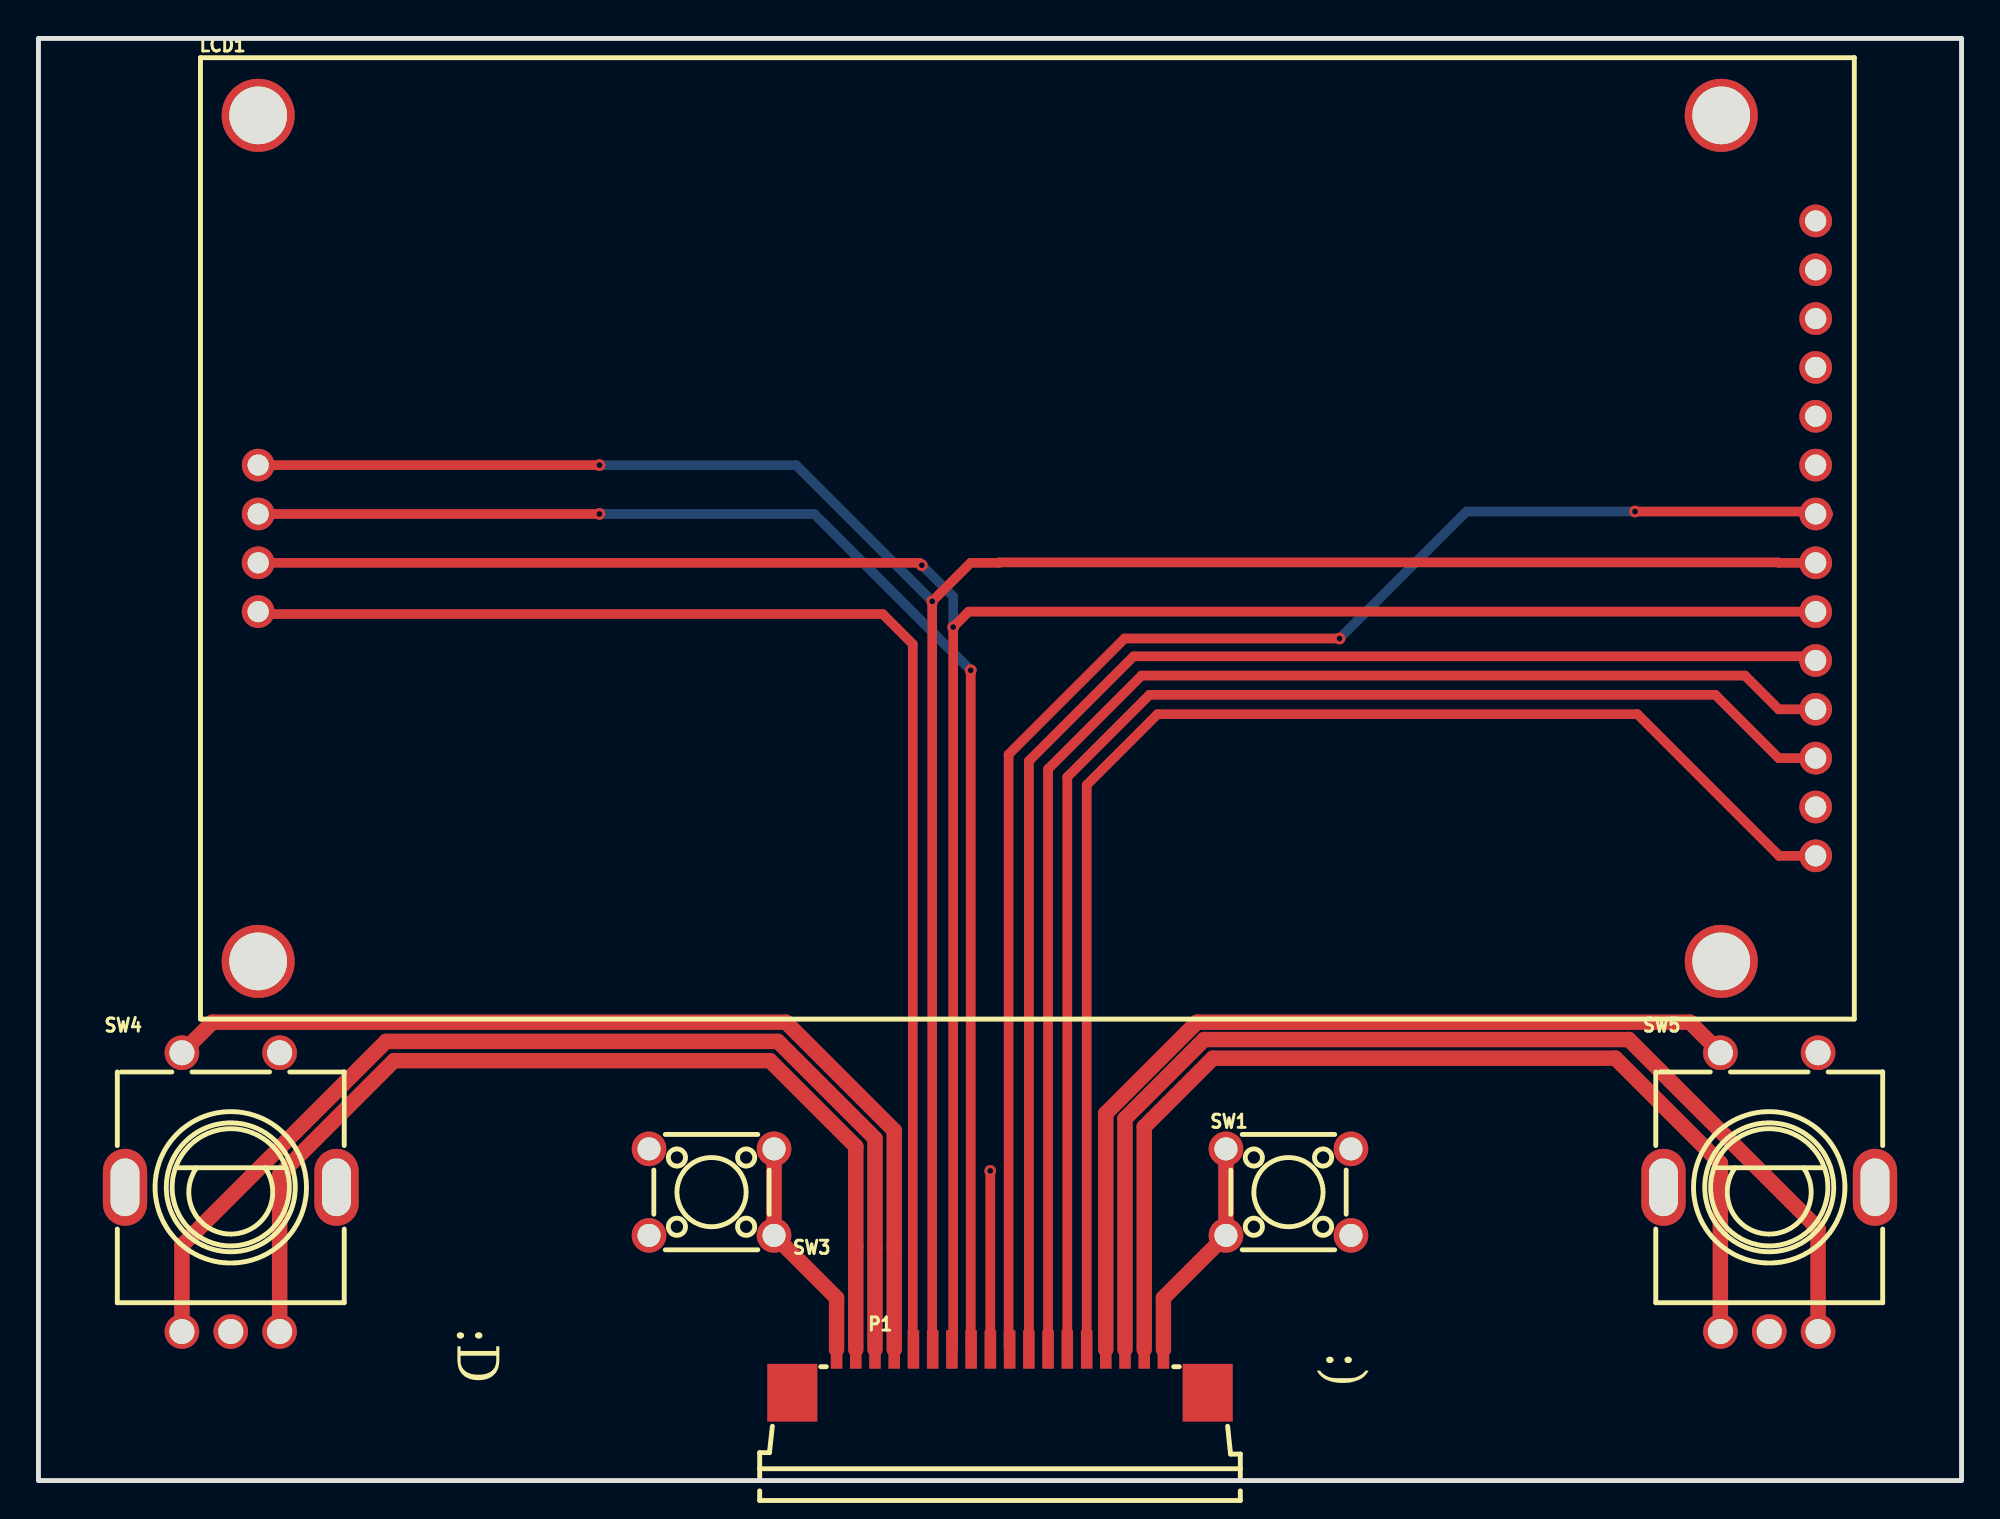
[diagram p6: board, top side]
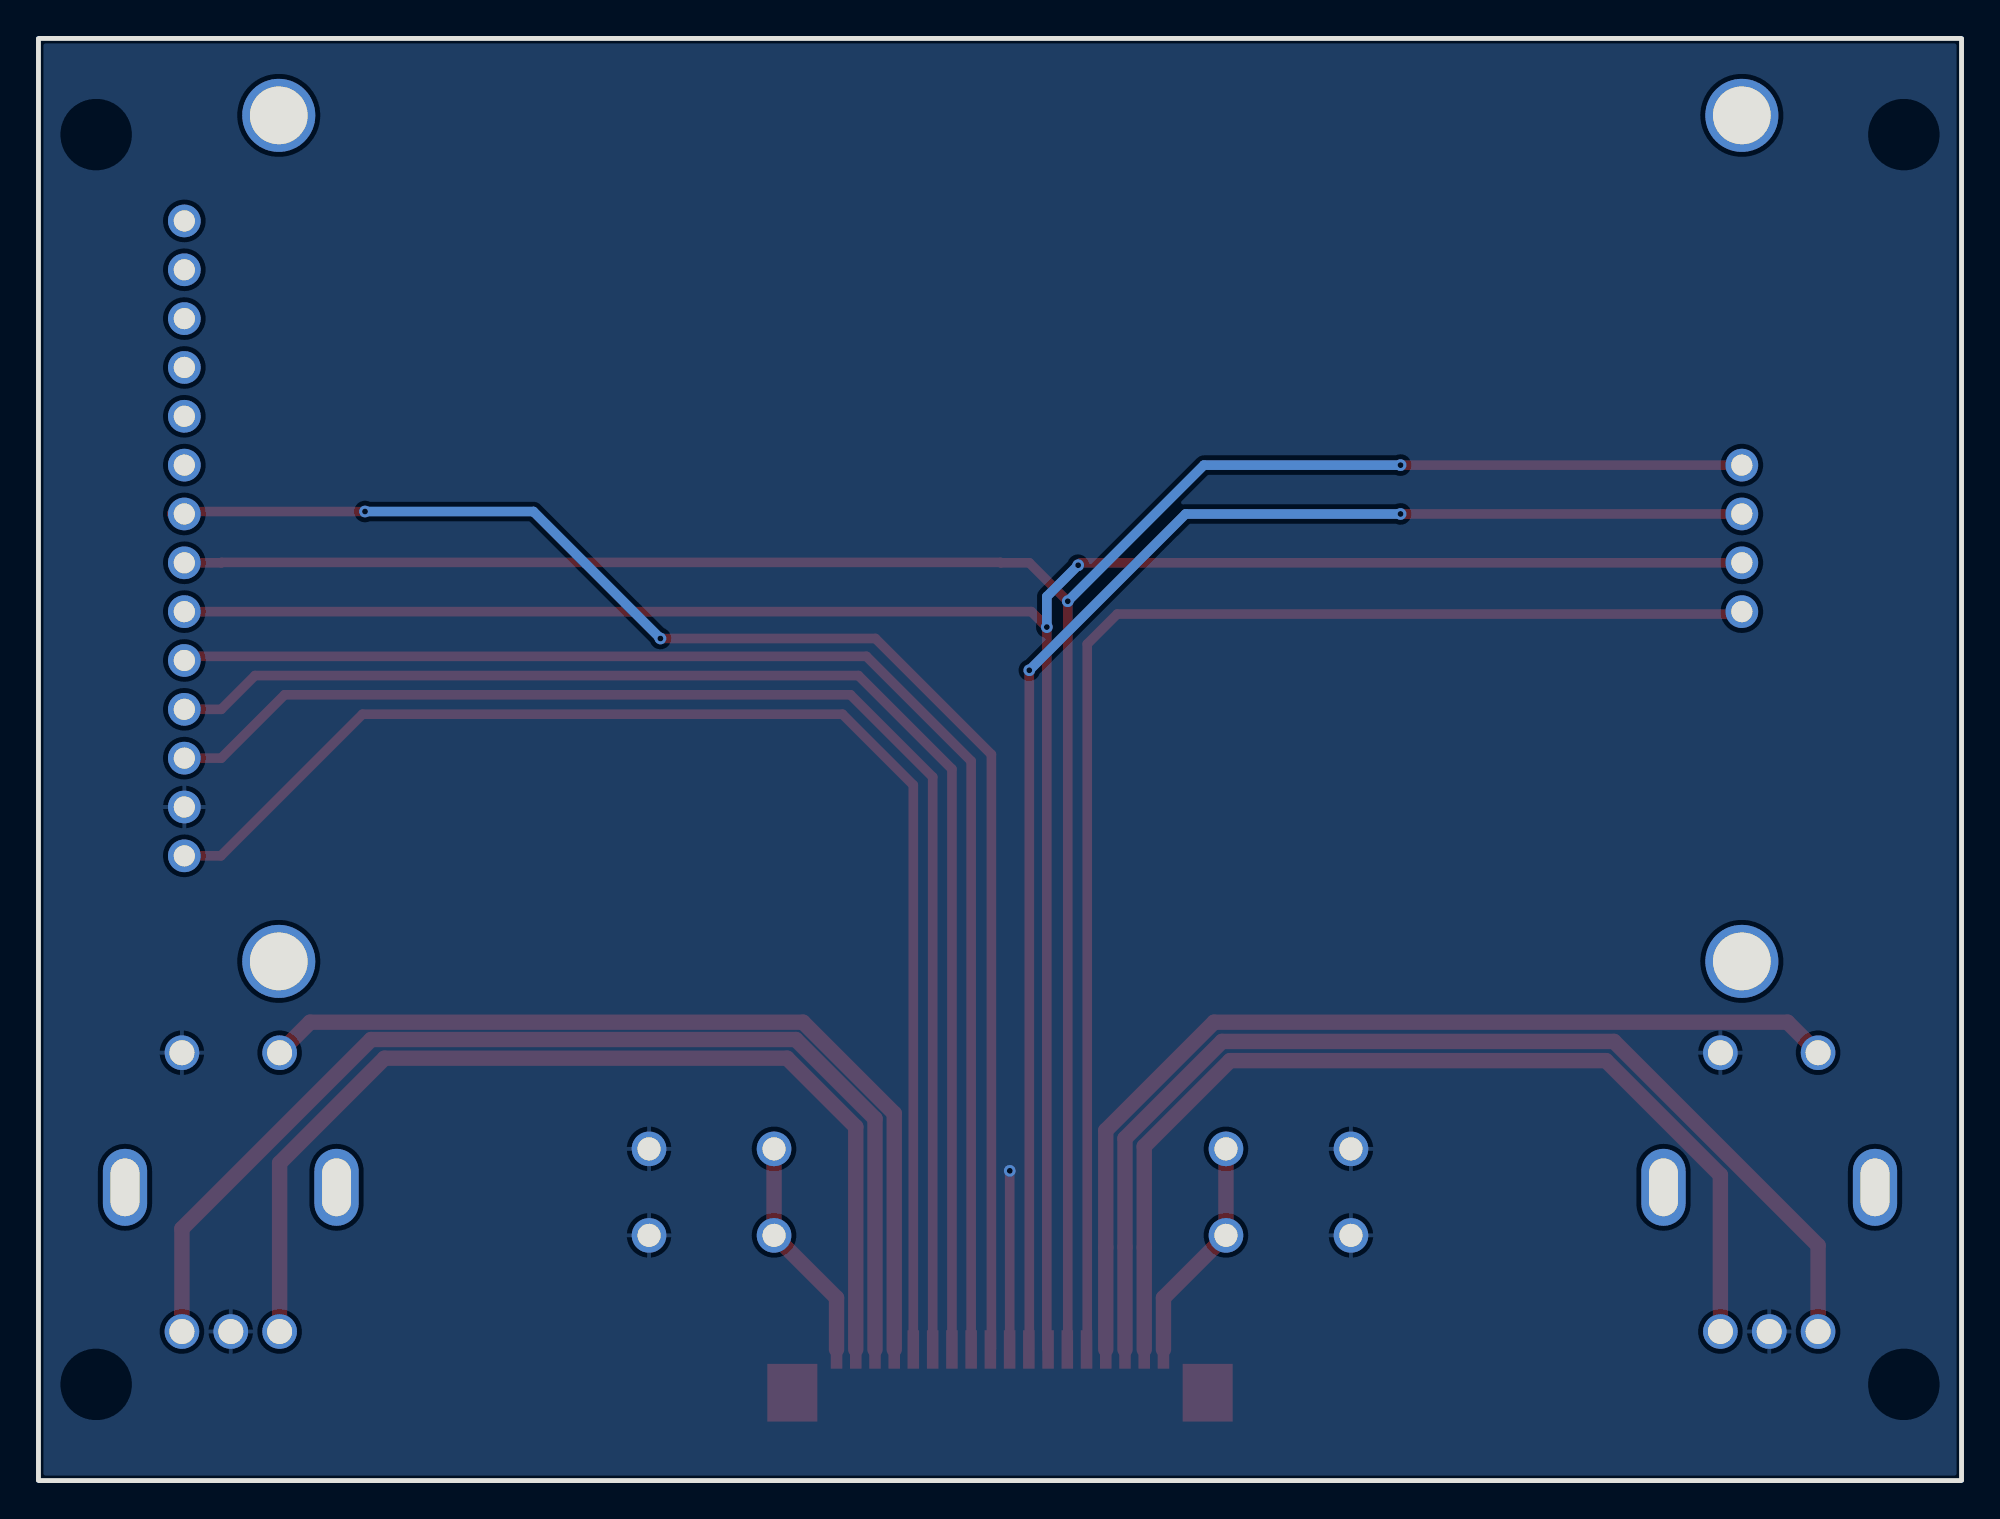
[diagram p7: board, bottom side, seen from below]

Outline 100 x 75 mm; copper layers: Top Layer, Bottom Layer. Coordinates in mm from the lower left corner of the outline.
Outline path: rectangle 0,75 100,0
Stack: Top Layer 0.035mm / Dielectric1 1.51mm FR4 er 4.5 / Bottom Layer 0.035mm

## Design rules (mm)
template: Custom Config
spacing copperThickness1oz (default): track to track 0.102, other pairs 0.152 to 0.3
spacing copperThickness2oz: track to track 0.203, other pairs 0.152 to 0.3
track width copperThickness1oz (default): min 0.127, default 0.8, max 2.54
track width copperThickness2oz: min 0.203, default 0.254, max 2.54
differential pair differentialPair (default): width min 0.127, default 0.254, max 2.54; gap min 0.152, default 0.152
via viaSize (default): diameter min 0.5, default 0.61, max 10; hole min 0.3, default 0.305, max 6.3

## Placement (name value [footprint] x y rotation side)
LCD1  HS12864G18B  [COMM-TH_HS12864G18B]  51.92 49 0 top
P1  AFA07-S18FCC-00  [FPC-SMD_18P-P1.00_AFA07-S18FCC-00]  50 5.69 0 top
SW1  TS-1002-07026  [SW-TH_4P-L6.0-W6.0-P4.50-LS6.5]  65 15 0 top
SW3  TS-1002-07026  [SW-TH_4P-L6.0-W6.0-P4.50-LS6.5]  35 15 180 top
SW4  EC11E15244G1  [SW-TH_EC11E15244G1]  10 15 0 top
SW5  EC11E15244G1  [SW-TH_EC11E15244G1]  90 15 0 top

## Footprints (pads in the part's own frame, mm; a bottom-side part is the same pattern mirrored in y, then rotated)
COMM-TH_HS12864G18B
  round 3.8 hole 3: 0(-40.495,22) 0(-40.495,-22) 0(35.585,22) 0(35.585,-22)
  round 1.7 hole 1.1: 1(40.495,-16.51) 2(40.495,-13.97) 3(40.495,-11.43) 4(40.495,-8.89) 5(40.495,-6.35) 6(40.495,-3.81) 7(40.495,-1.27) 8(40.495,1.27) 9(40.495,3.81) 10(40.495,6.35) 11(40.495,8.89) 12(40.495,11.43) 13(40.495,13.97) 14(40.495,16.51) 15(-40.495,-3.81) 16(-40.495,-1.27) 17(-40.495,1.27) 18(-40.495,3.81)
FPC-SMD_18P-P1.00_AFA07-S18FCC-00
  rect 0.6x2 smd: 1(-8.5,1.125) 2(-7.5,1.125) 3(-6.5,1.125) 4(-5.5,1.125) 5(-4.5,1.125) 6(-3.5,1.125) 7(-2.5,1.125) 8(-1.5,1.125) 9(-0.5,1.125) 10(0.5,1.125) 11(1.5,1.125) 12(2.5,1.125) 13(3.499,1.125) 14(4.509,1.125) 15(5.5,1.125) 16(6.5,1.125) 17(7.5,1.125) 18(8.5,1.125)
  rect 2.6x3 smd: 19(-10.8,-1.125) 20(10.8,-1.125)
SW-TH_4P-L6.0-W6.0-P4.50-LS6.5
  round 1.8 hole 1.2: 1(-3.25,2.25) 2(3.25,2.25) 3(-3.25,-2.25) 4(3.25,-2.25)
SW-TH_EC11E15244G1
  oval 2.3x4 hole 1.5x3: 6(5.5,0.25) 7(-5.5,0.25)
  round 1.8 hole 1.3: A(-2.54,-7.25) B(2.54,-7.25) C(0,-7.25) D(-2.54,7.25) E(2.54,7.25)

## Nets
As in the schematic.

Pads without a net: LCD1 0 9 10 11 12 13 14; P1 19 20; SW4 6 7; SW5 6 7

## Via types
v1: diameter 0.61, hole 0.305, Top Layer to Bottom Layer, 9 vias

## Routing (per net, layer and track width the routed paths; a pad name or vN(x,y) marks a point on that pad's centre or on a via; arc(x,y) is an arc through that point)
GND: length 9.3
  Top Layer w0.5: P1.9 49.5,6.82 49.5,16.1 v1(49.49,16.11)
VCC_3V3: length 71.8
  Top Layer w0.5: P1.14 54.51,36.17 58.19,39.86 83.15,39.86 90.51,32.49 LCD1.1
BUT1: length 11.8
  Top Layer w0.8: SW3.3 SW3.1 41.5,9.5 P1.1
BUT2: length 51.4
  Top Layer w0.8: P1.4 44.5,18.21 38.87,23.84 9.05,23.84 SW4.D
BUT3: length 46.9
  Top Layer w0.8: P1.15 55.5,19.09 60.24,23.84 85.87,23.84 SW5.D
BUT4: length 11.8
  Top Layer w0.8: SW1.1 SW1.3 58.5,9.5 P1.18
LCD_A0: length 73.9
  Top Layer w0.5: LCD1.5 92.2,42.86 56.95,42.86 51.5,37.42 P1.11
LCD_CS: length 71.8
  Top Layer w0.5: P1.13 53.5,36.59 57.77,40.87 87.2,40.87 90.5,37.57 LCD1.3
LCD_LED: length 79.5
  Top Layer w0.5: v1(83.02,50.4) 92.94,50.4 93.06,50.27 LCD1.8 ; P1.10 50.45,6.87 50.45,37.76 56.48,43.79 v1(67.66,43.79)
  Bottom Layer w0.5: v1(83.02,50.4) 74.26,50.4 v1(67.66,43.79)
LCD_RST: length 72.8
  Top Layer w0.5: P1.12 52.5,37 57.36,41.86 88.74,41.86 90.5,40.11 LCD1.4
ROT1_A: length 58
  Top Layer w0.8: P1.3 43.5,17.79 38.45,22.84 18.07,22.84 7.46,12.22 SW4.A
ROT1_B: length 53
  Top Layer w0.8: P1.2 42.5,17.38 38.04,21.84 18.49,21.84 12.54,15.89 SW4.B
ROT2_A: length 54
  Top Layer w0.8: P1.17 57.5,18.39 61.07,21.97 82,21.97 87.46,16.51 SW5.A
ROT2_B: length 59.2
  Top Layer w0.8: SW5.B 92.54,13.1 82.7,22.94 60.62,22.94 56.5,18.82 P1.16
SPI_MISO: length 75.8
  Top Layer w0.5: v1(29.17,50.27) LCD1.17 ; v1(48.48,42.14) 48.48,6.84 P1.8
  Bottom Layer w0.5: v1(29.17,50.27) 40.35,50.27 v1(48.48,42.14)
SPI_MOSI: length 121.2
  Top Layer w0.5: LCD1.16 45.81,47.73 v1(45.94,47.6) ; LCD1.6 48.37,45.19 v1(47.57,44.39) 47.57,6.88 P1.7
  Bottom Layer w0.5: v1(47.57,44.39) 47.57,45.97 v1(45.94,47.6)
SPI_SCL: length 123.7
  Top Layer w0.5: LCD1.7 90.5,47.73 90.47,47.75 49.97,47.75 49.95,47.73 48.48,47.73 v1(46.48,45.73) 46.48,6.84 P1.6 ; v1(29.17,52.81) LCD1.18
  Bottom Layer w0.5: v1(46.48,45.73) 39.4,52.81 v1(29.17,52.81)
ZK_CS: length 71.4
  Top Layer w0.5: LCD1.15 11.55,45.06 43.9,45.06 45.46,43.5 45.46,6.85 P1.5

## Copper pours and planes (outline as drawn; the poured copper is in the pictures)
GND on Bottom Layer: 0,75 100,75 100,0 0,0

## Text on the board
Top Silkscreen Layer: :D | :)
